# Altium project 2HE2E_Tester.PrjPcb (part 1 of 2)
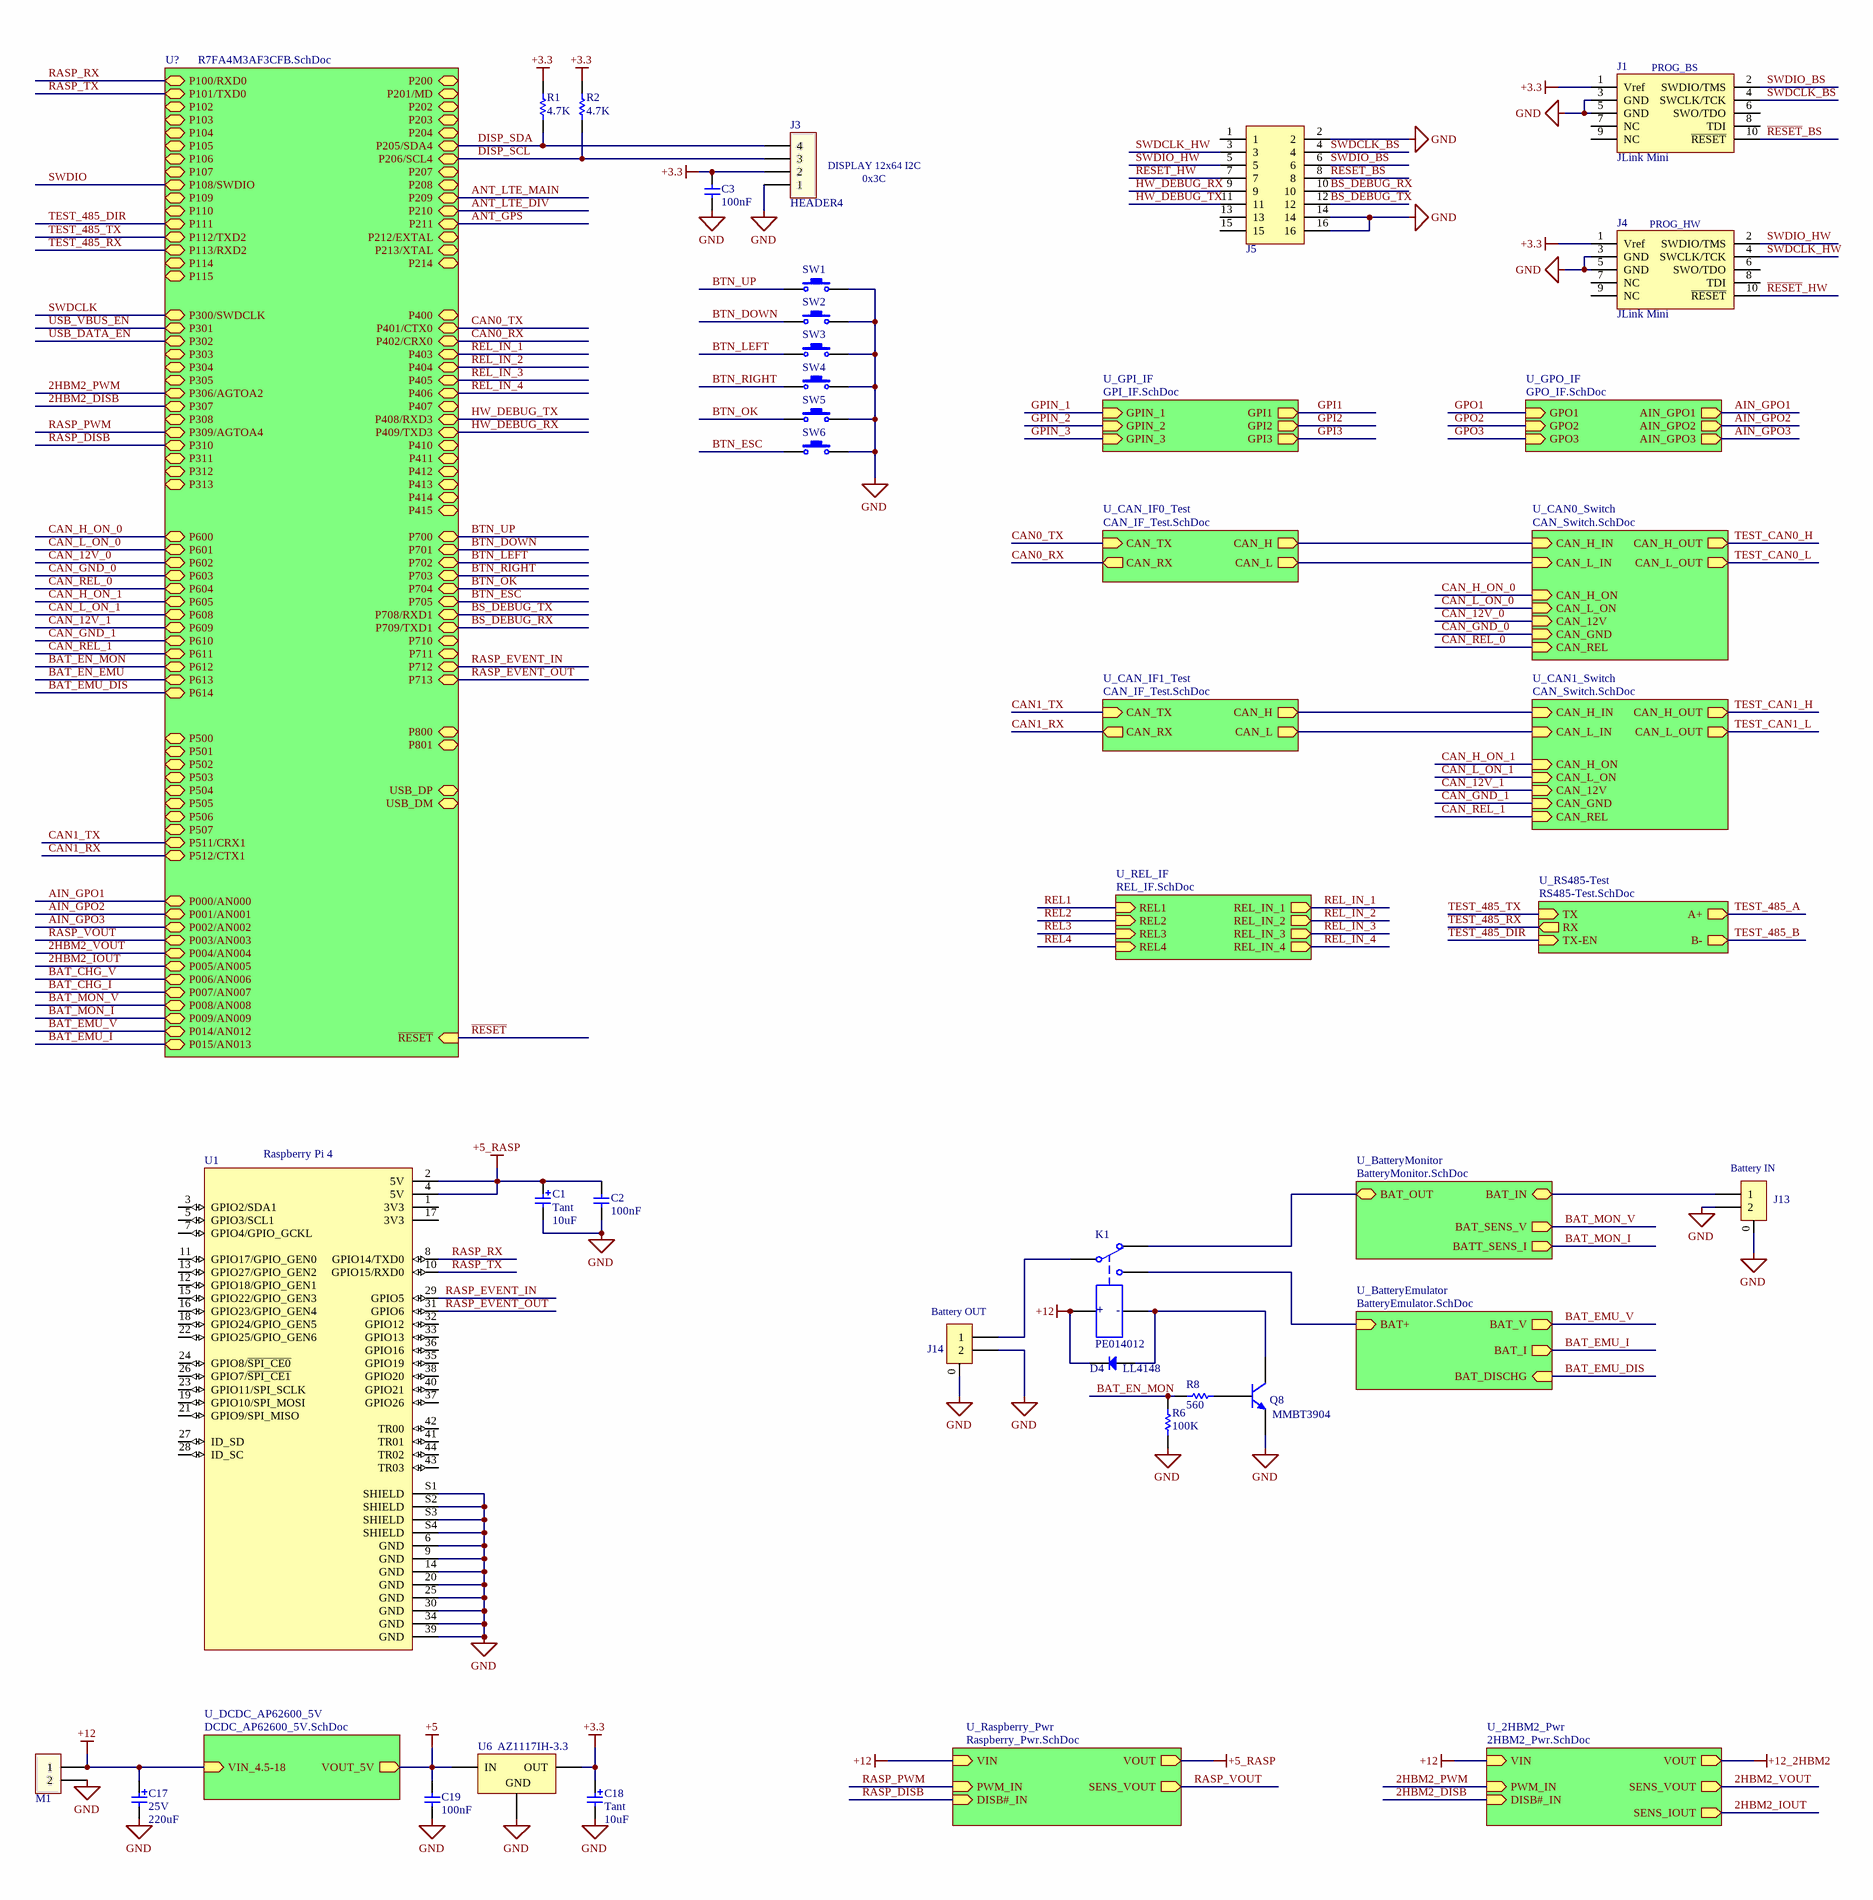
[diagram p0: 2HE2E_Tester.SchDoc, left]
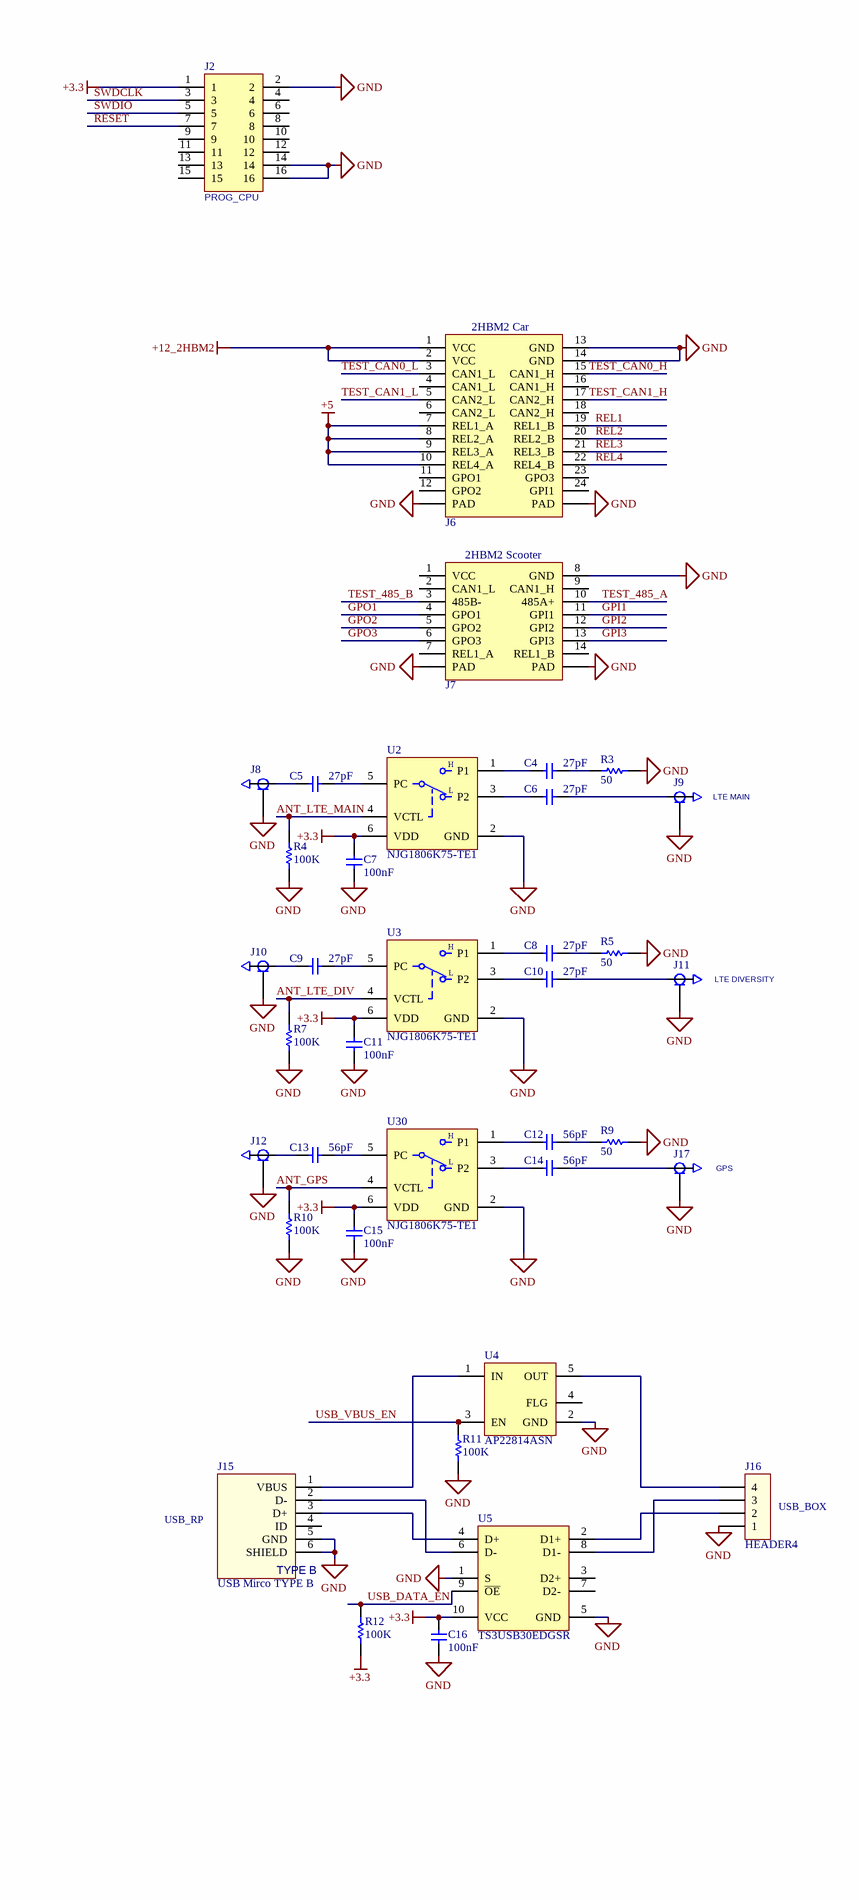
[diagram p1: 2HE2E_Tester.SchDoc, right]
13 sheets, 282 parts. Net scope: hierarchical (ports join the sheet entries above them; power ports are global).
Board file: 2HE2E_Tester.PcbDoc
Sheets:
  2HE2E_Tester.SchDoc
    U_RS485-Test = RS485-Test.SchDoc
    U_CAN_IF0_Test = CAN_IF_Test.SchDoc
    U_CAN_IF1_Test = CAN_IF_Test.SchDoc
    U_GPO_IF = GPO_IF.SchDoc
    U_REL_IF = REL_IF.SchDoc
    U_GPI_IF = GPI_IF.SchDoc
    U_DCDC_AP62600_5V = DCDC_AP62600_5V.SchDoc
    U_CAN0_Switch = CAN_Switch.SchDoc
    U_CAN1_Switch = CAN_Switch.SchDoc
    U? = R7FA4M3AF3CFB.SchDoc
    U_Raspberry_Pwr = Raspberry_Pwr.SchDoc
    U_2HBM2_Pwr = 2HBM2_Pwr.SchDoc
    U_BatteryEmulator = BatteryEmulator.SchDoc
    U_BatteryMonitor = BatteryMonitor.SchDoc

## Sheet 2HE2E_Tester.SchDoc
size A2; SheetNumber: 1; SheetTotal: 13

### Parts
C1  Tant  value 10uF  [Cap CASE B]
C2  value 100nF  [0603M-C]  (hidden comment: Cap Ceramic)
C3  value 100nF  [0603M-C]  (hidden comment: Cap Ceramic)
C4  value 27pF  [0402M-C]  (hidden comment: Cap Ceramic)
C5  value 27pF  [0402M-C]  (hidden comment: Cap Ceramic)
C6  value 27pF  [0402M-C]  (hidden comment: Cap Ceramic)
C7  value 100nF  [0603M-C]  (hidden comment: Cap Ceramic)
C8  value 27pF  [0402M-C]  (hidden comment: Cap Ceramic)
C9  value 27pF  [0402M-C]  (hidden comment: Cap Ceramic)
C10  value 27pF  [0402M-C]  (hidden comment: Cap Ceramic)
C11  value 100nF  [0603M-C]  (hidden comment: Cap Ceramic)
C12  value 56pF  [0402M-C]  (hidden comment: Cap Ceramic)
C13  value 56pF  [0402M-C]  (hidden comment: Cap Ceramic)
C14  value 56pF  [0402M-C]  (hidden comment: Cap Ceramic)
C15  value 100nF  [0603M-C]  (hidden comment: Cap Ceramic)
C16  value 100nF  [0603M-C]  (hidden comment: Cap Ceramic)
C17  25V  value 220uF  [Cap Elet SMD 8.0 mm CASE F-H10.5mm]
C18  Tant  value 10uF  [Cap CASE B]
C19  value 100nF  [0603M-C]  (hidden comment: Cap Ceramic)
D4  LL4148  [SOD80]
J1  JLink Mini  [HEADER5x2-127]
J2  Header 8x2  [Header 8x2 WE62101621021]  (value not drawn)
J3  HEADER4  [HEADER4]
J4  JLink Mini  [HEADER5x2-127]
J5  Header 8x2  [Header 8x2 WE62101621021]  (value not drawn)
J6  2HBM2 Car  [WR-MPC3 24N 662024231722]
J7  2HBM2 Scooter  [WR-MPC3 14N 662014231722]
J8  Antenna Ipex MHFx  [COAX IPEX MHF1_20279-001E-03]  (value not drawn)
J9  Antenna Ipex MHFx  [COAX IPEX MHF1_20279-001E-03]  (value not drawn)
J10  Antenna Ipex MHFx  [COAX IPEX MHF1_20279-001E-03]  (value not drawn)
J11  Antenna Ipex MHFx  [COAX IPEX MHF1_20279-001E-03]  (value not drawn)
J12  Antenna Ipex MHFx  [COAX IPEX MHF1_20279-001E-03]  (value not drawn)
J13  Connettore 2x1+GND  [JST_S2B-PH-SM4-TB]  (value not drawn)
J14  Connettore 2x1+GND  [JST_S2B-PH-SM4-TB]  (value not drawn)
J15  USB Mirco TYPE B  [USB Micro Type B - WE629105136821]
J16  HEADER4  [HEADER4]
J17  Antenna Ipex MHFx  [COAX IPEX MHF1_20279-001E-03]  (value not drawn)
K1  PE014012  [Relay PE]
M1  Morsetto 2 Poli  [Morsetto-2 poli-5.08]  (value not drawn)
Q8  MMBT3904  [SOT23 BSR14]
R1  value 4.7K  [0603M]  (hidden comment: Resistor)
R2  value 4.7K  [0603M]  (hidden comment: Resistor)
R3  value 50  [0603M]  (hidden comment: Resistor)
R4  value 100K  [0603M]  (hidden comment: Resistor)
R5  value 50  [0603M]  (hidden comment: Resistor)
R6  value 100K  [0603M]  (hidden comment: Resistor)
R7  value 100K  [0603M]  (hidden comment: Resistor)
R8  value 560  [0603M]  (hidden comment: Resistor)
R9  value 50  [0603M]  (hidden comment: Resistor)
R10  value 100K  [0603M]  (hidden comment: Resistor)
R11  value 100K  [0603M]  (hidden comment: Resistor)
R12  value 100K  [0603M]  (hidden comment: Resistor)
SW1  Button  [Button 6x6 PHT]  (value not drawn)
SW2  Button  [Button 6x6 PHT]  (value not drawn)
SW3  Button  [Button 6x6 PHT]  (value not drawn)
SW4  Button  [Button 6x6 PHT]  (value not drawn)
SW5  Button  [Button 6x6 PHT]  (value not drawn)
SW6  Button  [Button 6x6 PHT]  (value not drawn)
U1  Raspberry Pi 4  [MODULE RASPBERRY PI 4B]
U2  NJG1806K75-TE1  [NJG1806K75TE1]
U3  NJG1806K75-TE1  [NJG1806K75TE1]
U4  AP22814ASN  [U-DFN2020-127P600-6N]
U5  TS3USB30EDGSR  [TSSOP50P491-10N]
U6  AZ1117IH-3.3  [SOT223-SOT230P700X180-4N]
U30  NJG1806K75-TE1  [NJG1806K75TE1]

### Sub-sheets
U? = R7FA4M3AF3CFB.SchDoc: P400 (bidir), P403 (bidir), P404 (bidir), P405 (bidir), P406 (bidir), P700 (bidir), P701 (bidir), P702 (bidir), P703 (bidir), P704 (bidir), P705 (bidir), P213/XTAL (bidir), P212/EXTAL (bidir), P713 (bidir), P712 (bidir), P711 (bidir), P415 (bidir), P414 (bidir), P413 (bidir), P412 (bidir), P411 (bidir), P410 (bidir), P407 (bidir), USB_DM (bidir), USB_DP (bidir), P207 (bidir), P204 (bidir), P203 (bidir), P202 (bidir), P313 (bidir), P214 (bidir), P211 (bidir), P210 (bidir), P209 (bidir), P208 (bidir), P201/MD (bidir), P200 (bidir), P312 (bidir), P311 (bidir), P310 (bidir), P308 (bidir), P307 (bidir), P305 (bidir), P304 (bidir), P303 (bidir), P302 (bidir), P301 (bidir), P300/SWDCLK (bidir), P108/SWDIO (bidir), P109 (bidir), P110 (bidir), P111 (bidir), P114 (bidir), P115 (bidir), P608 (bidir), P609 (bidir), P610 (bidir), P611 (bidir), P612 (bidir), P613 (bidir), P614 (bidir), P605 (bidir), P604 (bidir), P603 (bidir), P602 (bidir), P601 (bidir), P600 (bidir), P107 (bidir), P106 (bidir), P105 (bidir), P104 (bidir), P103 (bidir), P102 (bidir), P800 (bidir), P801 (bidir), P500 (bidir), P501 (bidir), P502 (bidir), P503 (bidir), P504 (bidir), P505 (bidir), P506 (bidir), P507 (bidir), ~{RESET} (in), P512/CTX1 (bidir), P511/CRX1 (bidir), P401/CTX0 (bidir), P402/CRX0 (bidir), P002/AN002 (bidir), P001/AN001 (bidir), P000/AN000 (bidir), P101/TXD0 (bidir), P100/RXD0 (bidir), P112/TXD2 (bidir), P113/RXD2 (bidir), P710 (bidir), P709/TXD1 (bidir), P708/RXD1 (bidir), P409/TXD3 (bidir), P408/RXD3 (bidir), P306/AGTOA2 (bidir), P309/AGTOA4 (bidir), P005/AN005 (bidir), P004/AN004 (bidir), P003/AN003 (bidir), P007/AN007 (bidir), P006/AN006 (bidir), P015/AN013 (bidir), P014/AN012 (bidir), P009/AN009 (bidir), P008/AN008 (bidir), P206/SCL4 (bidir), P205/SDA4 (bidir)
U_2HBM2_Pwr = 2HBM2_Pwr.SchDoc: SENS_VOUT (out), SENS_IOUT (out), PWM_IN (in), DISB#_IN (in), VOUT (out), VIN (in)
U_BatteryEmulator = BatteryEmulator.SchDoc: BAT+ (in), BAT_DISCHG (in), BAT_V (out), BAT_I (out)
U_BatteryMonitor = BatteryMonitor.SchDoc: BAT_SENS_V (out), BATT_SENS_I (out), BAT_OUT (bidir), BAT_IN (bidir)
U_CAN0_Switch = CAN_Switch.SchDoc: CAN_H_IN (in), CAN_L_IN (in), CAN_REL (in), CAN_H_OUT (out), CAN_L_OUT (out), CAN_12V (in), CAN_GND (in), CAN_H_ON (in), CAN_L_ON (in)
U_CAN1_Switch = CAN_Switch.SchDoc: CAN_H_IN (in), CAN_L_IN (in), CAN_REL (in), CAN_H_OUT (out), CAN_L_OUT (out), CAN_12V (in), CAN_GND (in), CAN_H_ON (in), CAN_L_ON (in)
U_CAN_IF0_Test = CAN_IF_Test.SchDoc: CAN_TX (in), CAN_RX (out), CAN_L (out), CAN_H (out)
U_CAN_IF1_Test = CAN_IF_Test.SchDoc: CAN_TX (in), CAN_RX (out), CAN_L (out), CAN_H (out)
U_DCDC_AP62600_5V = DCDC_AP62600_5V.SchDoc: VIN_4.5-18 (in), VOUT_5V (out)
U_GPI_IF = GPI_IF.SchDoc: GPI1 (out), GPIN_1 (in), GPI2 (out), GPI3 (out), GPIN_2 (in), GPIN_3 (in)
U_GPO_IF = GPO_IF.SchDoc: GPO1 (in), GPO2 (in), GPO3 (in), AIN_GPO1 (out), AIN_GPO2 (out), AIN_GPO3 (out)
U_Raspberry_Pwr = Raspberry_Pwr.SchDoc: SENS_VOUT (out), PWM_IN (in), DISB#_IN (in), VOUT (out), VIN (in)
U_REL_IF = REL_IF.SchDoc: REL1 (in), REL_IN_1 (out), REL2 (in), REL_IN_2 (out), REL3 (in), REL_IN_3 (out), REL4 (in), REL_IN_4 (out)
U_RS485-Test = RS485-Test.SchDoc: RX (out), TX-EN (in), TX (in), A+ (out), B- (out)

### Nets
+3.3: C3.1 C7.1 C11.1 C15.1 C16.1 C18.1 J1.1(Vref) J2.1 J3.2 J4.1(Vref) R1.2 R2.2 R12.1 U2.6(VDD) U3.6(VDD) U5.10(VCC) U6.2(OUT) U30.6(VDD)
+5: C19.1 J6.7(REL1_A) J6.8(REL2_A) J6.9(REL3_A) J6.10(REL4_A) U6.3(IN) ; sheet U_DCDC_AP62600_5V/VOUT_5V
+5_RASP: C1.1 C2.1 U1.2(5V) U1.4(5V) ; sheet U_Raspberry_Pwr/VOUT  [project net VOUT_RP]
+12: C17.1 D4.2(K) K1.1 M1.1 ; sheet U_DCDC_AP62600_5V/VIN_4.5-18, sheet U_Raspberry_Pwr/VIN, sheet U_2HBM2_Pwr/VIN
+12_2HBM2: J6.1(VCC) J6.2(VCC) ; sheet U_2HBM2_Pwr/VOUT  [project net VOUT_2H]
GND: C1.2 C2.2 C3.2 C7.2 C11.2 C15.2 C16.2 C17.2 C18.2 C19.2 J1.3(GND) J1.5(GND) J2.2 J2.14 J2.16 J3.1 J4.3(GND) J4.5(GND) J5.2 J5.14 J5.16 J6.13(GND) J6.14(GND) J6.MP1(PAD) J6.MP2(PAD) J7.8(GND) J7.MP1(PAD) J7.MP2(PAD) J8.2(GND) J9.2(GND) J10.2(GND) J11.2(GND) J12.2(GND) J13.0 J13.2 J14.0 J14.2 J15.5(GND) J15.6(SHIELD) J16.1 J17.2(GND) M1.2 Q8.3(E) R3.1 R4.1 R5.1 R6.2 R7.1 R9.1 R10.1 R11.1 SW1.2 SW2.2 SW3.2 SW4.2 SW5.2 SW6.2 U1.6(GND) U1.9(GND) U1.14(GND) U1.20(GND) U1.25(GND) U1.30(GND) U1.34(GND) U1.39(GND) U1.S1(SHIELD) U1.S2(SHIELD) U1.S3(SHIELD) U1.S4(SHIELD) U2.2(GND) U3.2(GND) U4.2(GND) U5.1(S) U5.5(GND) U6.1(GND) U30.2(GND)
2HBM2_DISB: sheet U?/P307, sheet U_2HBM2_Pwr/DISB#_IN
2HBM2_IOUT: sheet U?/P005/AN005, sheet U_2HBM2_Pwr/SENS_IOUT
2HBM2_PWM: sheet U?/P306/AGTOA2, sheet U_2HBM2_Pwr/PWM_IN
2HBM2_VOUT: sheet U?/P004/AN004, sheet U_2HBM2_Pwr/SENS_VOUT
AIN_GPO1: sheet U_GPO_IF/AIN_GPO1, sheet U?/P000/AN000
AIN_GPO2: sheet U_GPO_IF/AIN_GPO2, sheet U?/P001/AN001
AIN_GPO3: sheet U_GPO_IF/AIN_GPO3, sheet U?/P002/AN002
ANT_GPS: R10.2 U30.4(VCTL) ; sheet U?/P211
ANT_LTE_DIV: R7.2 U3.4(VCTL) ; sheet U?/P210
ANT_LTE_MAIN: R4.2 U2.4(VCTL) ; sheet U?/P209
BAT_EMU_DIS: sheet U?/P614, sheet U_BatteryEmulator/BAT_DISCHG
BAT_EMU_I: sheet U?/P015/AN013, sheet U_BatteryEmulator/BAT_I
BAT_EMU_V: sheet U?/P014/AN012, sheet U_BatteryEmulator/BAT_V
BAT_EN_MON: R6.1 R8.1 ; sheet U?/P612
BAT_MON_I: sheet U?/P009/AN009, sheet U_BatteryMonitor/BATT_SENS_I
BAT_MON_V: sheet U?/P008/AN008, sheet U_BatteryMonitor/BAT_SENS_V
BS_DEBUG_RX: J5.10 ; sheet U?/P709/TXD1
BS_DEBUG_TX: J5.12 ; sheet U?/P708/RXD1
BTN_DOWN: SW2.1 ; sheet U?/P701
BTN_ESC: SW6.1 ; sheet U?/P705
BTN_LEFT: SW3.1 ; sheet U?/P702
BTN_OK: SW5.1 ; sheet U?/P704
BTN_RIGHT: SW4.1 ; sheet U?/P703
BTN_UP: SW1.1 ; sheet U?/P700
CAN0_RX: sheet U_CAN_IF0_Test/CAN_RX, sheet U?/P402/CRX0
CAN0_TX: sheet U_CAN_IF0_Test/CAN_TX, sheet U?/P401/CTX0
CAN1_RX: sheet U_CAN_IF1_Test/CAN_RX, sheet U?/P512/CTX1
CAN1_TX: sheet U_CAN_IF1_Test/CAN_TX, sheet U?/P511/CRX1
CAN_12V_0: sheet U_CAN0_Switch/CAN_12V, sheet U?/P602
CAN_12V_1: sheet U_CAN1_Switch/CAN_12V, sheet U?/P609
CAN_GND_0: sheet U_CAN0_Switch/CAN_GND, sheet U?/P603
CAN_GND_1: sheet U_CAN1_Switch/CAN_GND, sheet U?/P610
CAN_H_ON_0: sheet U_CAN0_Switch/CAN_H_ON, sheet U?/P600
CAN_H_ON_1: sheet U_CAN1_Switch/CAN_H_ON, sheet U?/P605
CAN_L_ON_0: sheet U_CAN0_Switch/CAN_L_ON, sheet U?/P601
CAN_L_ON_1: sheet U_CAN1_Switch/CAN_L_ON, sheet U?/P608
CAN_REL_0: sheet U_CAN0_Switch/CAN_REL, sheet U?/P604
CAN_REL_1: sheet U_CAN1_Switch/CAN_REL, sheet U?/P611
DISP_SCL: J3.3 R2.1 ; sheet U?/P206/SCL4
DISP_SDA: J3.4 R1.1 ; sheet U?/P205/SDA4
GPI1: J7.11(GPI1) ; sheet U_GPI_IF/GPI1
GPI2: J7.12(GPI2) ; sheet U_GPI_IF/GPI2
GPI3: J7.13(GPI3) ; sheet U_GPI_IF/GPI3
GPO1: J7.4(GPO1) ; sheet U_GPO_IF/GPO1
GPO2: J7.5(GPO2) ; sheet U_GPO_IF/GPO2
GPO3: J7.6(GPO3) ; sheet U_GPO_IF/GPO3
HW_DEBUG_RX: J5.9 ; sheet U?/P409/TXD3
HW_DEBUG_TX: J5.11 ; sheet U?/P408/RXD3
~{RESET}: J2.7 ; sheet U?/~{RESET}
~{RESET}_BS: J1.10(~{RESET}) J5.8
~{RESET}_HW: J4.10(~{RESET}) J5.7
RASP_DISB: sheet U?/P310, sheet U_Raspberry_Pwr/DISB#_IN
RASP_EVENT_IN: U1.29(GPIO5) ; sheet U?/P712
RASP_EVENT_OUT: U1.31(GPIO6) ; sheet U?/P713
RASP_PWM: sheet U?/P309/AGTOA4, sheet U_Raspberry_Pwr/PWM_IN
RASP_RX: U1.8(GPIO14/TXD0) ; sheet U?/P100/RXD0
RASP_TX: U1.10(GPIO15/RXD0) ; sheet U?/P101/TXD0
RASP_VOUT: sheet U?/P003/AN003, sheet U_Raspberry_Pwr/SENS_VOUT
REL1: J6.19(REL1_B) ; sheet U_REL_IF/REL1
REL2: J6.20(REL2_B) ; sheet U_REL_IF/REL2
REL3: J6.21(REL3_B) ; sheet U_REL_IF/REL3
REL4: J6.22(REL4_B) ; sheet U_REL_IF/REL4
REL_IN_1: sheet U_REL_IF/REL_IN_1, sheet U?/P403
REL_IN_2: sheet U_REL_IF/REL_IN_2, sheet U?/P404
REL_IN_3: sheet U_REL_IF/REL_IN_3, sheet U?/P405
REL_IN_4: sheet U_REL_IF/REL_IN_4, sheet U?/P406
SWDCLK: J2.3 ; sheet U?/P300/SWDCLK
SWDCLK_BS: J1.4(SWCLK/TCK) J5.4
SWDCLK_HW: J4.4(SWCLK/TCK) J5.3
SWDIO: J2.5 ; sheet U?/P108/SWDIO
SWDIO_BS: J1.2(SWDIO/TMS) J5.6
SWDIO_HW: J4.2(SWDIO/TMS) J5.5
TEST_485_A: J7.10(485A+) ; sheet U_RS485-Test/A+
TEST_485_B: J7.3(485B-) ; sheet U_RS485-Test/B-
TEST_485_DIR: sheet U_RS485-Test/TX-EN, sheet U?/P111
TEST_485_RX: sheet U_RS485-Test/RX, sheet U?/P113/RXD2
TEST_485_TX: sheet U_RS485-Test/TX, sheet U?/P112/TXD2
TEST_CAN0_H: J6.15(CAN1_H) ; sheet U_CAN0_Switch/CAN_H_OUT
TEST_CAN0_L: J6.3(CAN1_L) ; sheet U_CAN0_Switch/CAN_L_OUT
TEST_CAN1_H: J6.17(CAN2_H) ; sheet U_CAN1_Switch/CAN_H_OUT
TEST_CAN1_L: J6.5(CAN2_L) ; sheet U_CAN1_Switch/CAN_L_OUT
USB_DATA_EN: R12.2 U5.9(~{OE}) ; sheet U?/P302
USB_VBUS_EN: R11.2 U4.3(EN) ; sheet U?/P301
VOUT: K1.10 ; sheet U_BatteryMonitor/BAT_OUT
NetC4_1: C4.1 U2.1(P1)
NetC4_2: C4.2 R3.2
NetC5_1: C5.1 J8.1(SIGNAL)
NetC5_2: C5.2 U2.5(PC)
NetC6_1: C6.1 U2.3(P2)
NetC6_2: C6.2 J9.1(SIGNAL)
NetC8_1: C8.1 U3.1(P1)
NetC8_2: C8.2 R5.2
NetC9_1: C9.1 J10.1(SIGNAL)
NetC9_2: C9.2 U3.5(PC)
NetC10_1: C10.1 U3.3(P2)
NetC10_2: C10.2 J11.1(SIGNAL)
NetC12_1: C12.1 U30.1(P1)
NetC12_2: C12.2 R9.2
NetC13_1: C13.1 J12.1(SIGNAL)
NetC13_2: C13.2 U30.5(PC)
NetC14_1: C14.1 U30.3(P2)
NetC14_2: C14.2 J17.1(SIGNAL)
NetC37_1_2: sheet U_CAN_IF0_Test/CAN_L, sheet U_CAN0_Switch/CAN_L_IN
NetC37_2_2: sheet U_CAN_IF1_Test/CAN_L, sheet U_CAN1_Switch/CAN_L_IN
NetC38_1_2: sheet U_CAN_IF0_Test/CAN_H, sheet U_CAN0_Switch/CAN_H_IN
NetC38_2_2: sheet U_CAN_IF1_Test/CAN_H, sheet U_CAN1_Switch/CAN_H_IN
NetD4_1: D4.1(A) K1.6 Q8.1(C)
NetJ13_1: J13.1 ; sheet U_BatteryMonitor/BAT_IN
NetJ14_1: J14.1 K1.7
NetJ15_1: J15.1(VBUS) U4.1(IN)
NetJ15_2: J15.2(D-) U5.6(D-)
NetJ15_3: J15.3(D+) U5.4(D+)
NetJ16_2: J16.2 U5.2(D1+)
NetJ16_3: J16.3 U5.8(D1-)
NetJ16_4: J16.4 U4.5(OUT)
NetK1_12: K1.12 ; sheet U_BatteryEmulator/BAT+
NetQ8_2: Q8.2(B) R8.2

Not connected (* = marked no-connect by the designer): J1 6(SWO/TDO) 7(NC) 8(TDI) 9(NC); J2 4 6 8 9 10 11 12 13 15; J4 6(SWO/TDO) 7(NC) 8(TDI) 9(NC); J5 1 13 15; J6 4(CAN1_L) 6(CAN2_L) 11(GPO1) 12(GPO2) 16(CAN1_H) 18(CAN2_H) 23(GPO3) 24(GPI1); J7 1(VCC) 2(CAN1_L) 7(REL1_A) 9(CAN1_H) 14(REL1_B); J15 4(ID); U1 1(3V3) 3(GPIO2/SDA1) 5(GPIO3/SCL1) 7(GPIO4/GPIO_GCKL) 11(GPIO17/GPIO_GEN0) 12(GPIO18/GPIO_GEN1) 13(GPIO27/GPIO_GEN2) 15(GPIO22/GPIO_GEN3) 16(GPIO23/GPIO_GEN4) 17(3V3) 18(GPIO24/GPIO_GEN5) 19(GPIO10/SPI_MOSI) 21(GPIO9/SPI_MISO) 22(GPIO25/GPIO_GEN6) 23(GPIO11/SPI_SCLK) 24(GPIO8/~{SPI_CE0}) 26(GPIO7/~{SPI_CE1}) 27(ID_SD) 28(ID_SC) 32(GPIO12) 33(GPIO13) 35(GPIO19) 36(GPIO16) 37(GPIO26) 38(GPIO20) 40(GPIO21) 41(TR01) 42(TR00) 43(TR03) 44(TR02); U4 4(FLG); U5 3(D2+) 7(D2-)

### Notes on the sheet
- (near J1) PROG_BS
- (near J3) DISPLAY 12x64 I2C
- 0x3C
- (near J2) PROG_CPU
- (near J4) PROG_HW
- (near J9) LTE MAIN
- (near J11) LTE DIVERSITY
- (near J13) Battery IN
- (near J17) GPS
- (near J14) Battery OUT
- USB_RP
- (near J16) USB_BOX
- Title
- Size:
- Date:
- A4
- Number:
- Time:
- Revision:
- Sheet
- of
- File:
- (in symbol NJG1806K75-TE1) H; L
- (in symbol Relay SPDT) +; -
- (in symbol USB Micro_TYPEB) TYPE B

### Library data of the parts
C1 C18 = Cap Tantalio: Capacitor tantalio SMD
C2-C16 C19 = Cap Ceramic: Ceramic Capacitor
C17 = Cap Elettrolitico: Condensatore elettrolitico
D4 = Diodo: Small Signal Diode
J1 J4 = Connettore JLink Mini: Connettore JTAG/SWD 5x2 P1.27 JLink Mini
J2 J5 = Header 8x2: WE 62101621021
J3 J16 = HEADER4: Header 4 pin
J6 = Connettore 2Hire 2HBM2_Car: Connettore 12x2 WE 662024231722
J7 = Connettore 2Hire 2HBM2_Scooter: Connettore 7x2 WE 662014231722
J8-J12 J17 = Connettore Ipex MHFx: 1 POS Vertical SMD Small form factor with big performance through 6 GHz connector, RF, micro-coaxial MHF x Receptacle; MP: 20449-001E-03; MF: I-PEX; SnapEDA_Link: https://www.snapeda.com/parts/20449-001E-03/I-PEX/view-part/?ref=snap; Package: None; Check_prices: https://www.snapeda.com/parts/20449-001E-03/I-PEX/view-part/?ref=eda; Purchase-URL: https://pricing.snapeda.com/search/part/20449-001E-03/?ref=eda; Price: None; Value: *; Availability: In Stock
J13 J14 = Connettore 2x1+GND: Connettore 2x1
J15 = USB Micro_TYPEB: Connettore MicroUSB Client (TYPE B)
K1 = Relay SPDT: Relay DPDT Coil 12V PE014012
M1 = Morsetto 2 Poli: Morsetto 2 poli PCB
Q8 = Transistor NPN: NPN Bipolar Transistor
SW1-SW6 = Button: Button SPST
U1 = Raspberry Pi 4: BCM2711 Raspberry Pi 4 Model B 4GB - ARM Cortex-A72 MPU Embedded Evaluation Board; MP: RASPBERRY PI 4B/4GB; Price: None; MF: Raspberry Pi; Check_prices: https://www.snapeda.com/parts/RASPBERRY%20PI%204B/4GB/Raspberry+Pi/view-part/?ref=eda; Value: *; Purchase-URL: https://pricing.snapeda.com/search/part/RASPBERRY PI 4B/4GB/?ref=eda; Availability: In Stock; SnapEDA_Link: https://www.snapeda.com/parts/RASPBERRY%20PI%204B/4GB/Raspberry+Pi/view-part/?ref=snap; Package: None
U2 U3 U30 = NJG1806K75-TE1: RF Switch ICs 1bit SPDT Switch IC GaAs MMIC
U4 = AP22814ASN: Single  channel current-limited  integrated high-side power switch - Active High - DFN
U5 = TS3USB30EDGSR: High-Speed USB 2.0 (480-Mbps) 1:2 Multiplexer/Demultiplexer Switch With Single Enable
U6 = AZ1117IH: Regolatore LDO fixed 3.3V 1A

## Sheet RS485-Test.SchDoc: RS485 Interface
size A4; DrawnBy: Marini; DocumentNumber: 2HSGB; Revision: 1.1; SheetNumber: 4; SheetTotal: 13
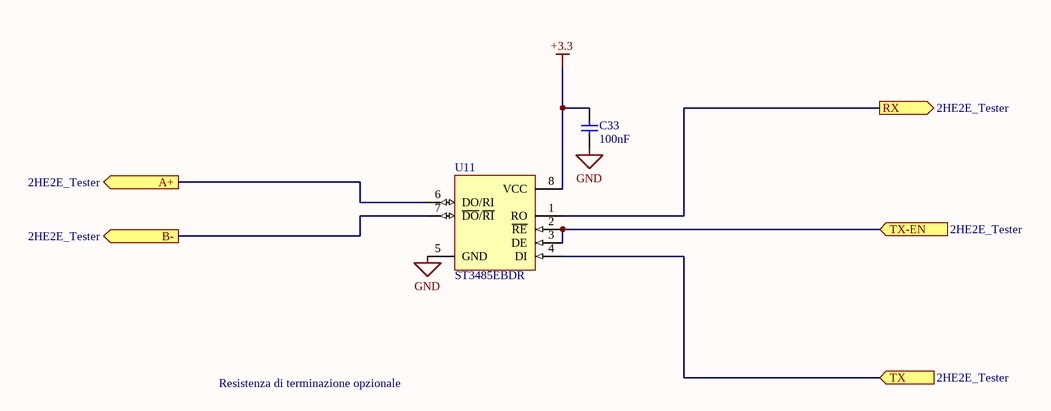
[diagram p2: RS485-Test.SchDoc]

### Parts
C33  value 100nF  [0603M-C]  (hidden comment: Cap Ceramic)
U11  ST3485EBDR  [SOIC127P600-8N]

### Ports
A+ (out, see 2HE2E_Tester), B- (out, see 2HE2E_Tester), RX (out, see 2HE2E_Tester), TX (in, see 2HE2E_Tester), TX-EN (in, see 2HE2E_Tester)

### Nets
+3.3: C33.1 U11.8(VCC)
GND: C33.2 U11.5(GND)
TEST_485_A: U11.6(DO/RI) ; port A+
TEST_485_B: U11.7(~{DO}/~{RI}) ; port B-
TEST_485_DIR: U11.2(~{RE}) U11.3(DE) ; port TX-EN
TEST_485_RX: U11.1(RO) ; port RX
TEST_485_TX: U11.4(DI) ; port TX

### Notes on the sheet
- Resistenza di terminazione opzionale

### Library data of the parts
C33 = Cap Ceramic: Ceramic Capacitor 25V
U11 = DS75176BM: Multipoint RS-485/RS-422 Transceiver

## Sheet CAN_IF_Test.SchDoc
size A4; SheetNumber: 7; SheetTotal: 13
Used 2 times, as channels U_CAN_IF0_Test, U_CAN_IF1_Test. Parts and nets are listed once, with the designators drawn on the sheet.
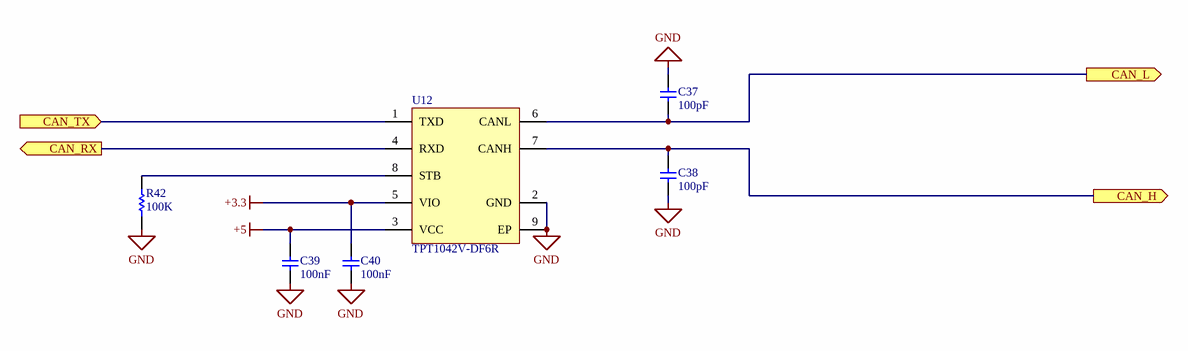
[diagram p3: CAN_IF_Test.SchDoc]

### Parts
C37  value 100pF  [0603M]  (hidden comment: Cap Ceramic)
C38  value 100pF  [0603M]  (hidden comment: Cap Ceramic)
C39  value 100nF  [0603M-C]  (hidden comment: Cap Ceramic)
C40  value 100nF  [0603M-C]  (hidden comment: Cap Ceramic)
R42  value 100K  [0603M]  (hidden comment: Resistor)
U12  TPT1042V-DF6R  [HVSON8-0.65mm]

### Ports
CAN_H (out, see 2HE2E_Tester), CAN_L (out, see 2HE2E_Tester), CAN_RX (out, see 2HE2E_Tester), CAN_TX (in, see 2HE2E_Tester)

### Nets
+3.3: C40.2 U12.5(VIO)
+5: C39.2 U12.3(VCC)
GND: C37.1 C38.1 C39.1 C40.1 R42.1 U12.2(GND) U12.9(EP)
CAN_H: C38.2 U12.7(CANH) ; port CAN_H
CAN_L: C37.2 U12.6(CANL) ; port CAN_L
CAN_RX: U12.4(RXD) ; port CAN_RX
CAN_TX: U12.1(TXD) ; port CAN_TX
NetR42_2: R42.2 U12.8(STB)

### Channels
U_CAN_IF0_Test: designators end in _1; ports CAN_H=NetC38_1_2 CAN_L=NetC37_1_2 CAN_RX=CAN0_RX CAN_TX=CAN0_TX
U_CAN_IF1_Test: designators end in _2; ports CAN_H=NetC38_2_2 CAN_L=NetC37_2_2 CAN_RX=CAN1_RX CAN_TX=CAN1_TX

### Notes on the sheet
- Title
- Size:
- Date:
- A4
- Number:
- Time:
- Revision:
- Sheet
- of
- File:

### Library data of the parts
C37 C38 = Cap Ceramic: Ceramic Capacitor 50V
C39 C40 = Cap Ceramic: Ceramic Capacitor 25V
U12 = TPT1042V: High-speed CAN transceiver with Standby mode and VIO

## Sheet GPO_IF.SchDoc
size A4; SheetNumber: 6; SheetTotal: 13
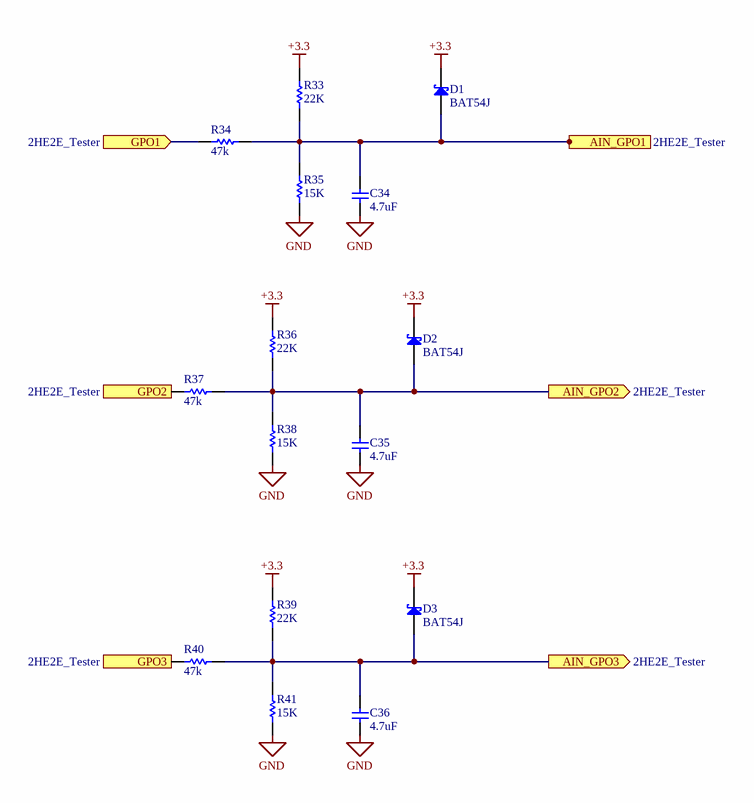
[diagram p4: GPO_IF.SchDoc]

### Parts
C34  value 4.7uF  [0603M-C]  (hidden comment: Cap Ceramic)
C35  value 4.7uF  [0603M-C]  (hidden comment: Cap Ceramic)
C36  value 4.7uF  [0603M-C]  (hidden comment: Cap Ceramic)
D1  BAT54J  [SOD323]
D2  BAT54J  [SOD323]
D3  BAT54J  [SOD323]
R33  value 22K  [0603M]  (hidden comment: Resistor)
R34  value 47k  [0603M]  (hidden comment: Resistor)
R35  value 15K  [0603M]  (hidden comment: Resistor)
R36  value 22K  [0603M]  (hidden comment: Resistor)
R37  value 47k  [0603M]  (hidden comment: Resistor)
R38  value 15K  [0603M]  (hidden comment: Resistor)
R39  value 22K  [0603M]  (hidden comment: Resistor)
R40  value 47k  [0603M]  (hidden comment: Resistor)
R41  value 15K  [0603M]  (hidden comment: Resistor)

### Ports
AIN_GPO1 (out, see 2HE2E_Tester), AIN_GPO2 (out, see 2HE2E_Tester), AIN_GPO3 (out, see 2HE2E_Tester), GPO1 (in, see 2HE2E_Tester), GPO2 (in, see 2HE2E_Tester), GPO3 (in, see 2HE2E_Tester)

### Nets
+3.3: D1.2(K) D2.2(K) D3.2(K) R33.2 R36.2 R39.2
GND: C34.1 C35.1 C36.1 R35.1 R38.1 R41.1
AIN_GPO1: C34.2 D1.1(A) R33.1 R34.2 R35.2 ; port AIN_GPO1
AIN_GPO2: C35.2 D2.1(A) R36.1 R37.2 R38.2 ; port AIN_GPO2
AIN_GPO3: C36.2 D3.1(A) R39.1 R40.2 R41.2 ; port AIN_GPO3
GPO1: R34.1 ; port GPO1
GPO2: R37.1 ; port GPO2
GPO3: R40.1 ; port GPO3

### Notes on the sheet
- Title
- Size:
- Date:
- A4
- Number:
- Time:
- Revision:
- Sheet
- of
- File:

### Library data of the parts
C34-C36 = Cap Ceramic: Ceramic Capacitor
D1-D3 = Diodo Schottky

## Sheet REL_IF.SchDoc
size A4; SheetNumber: 5; SheetTotal: 13
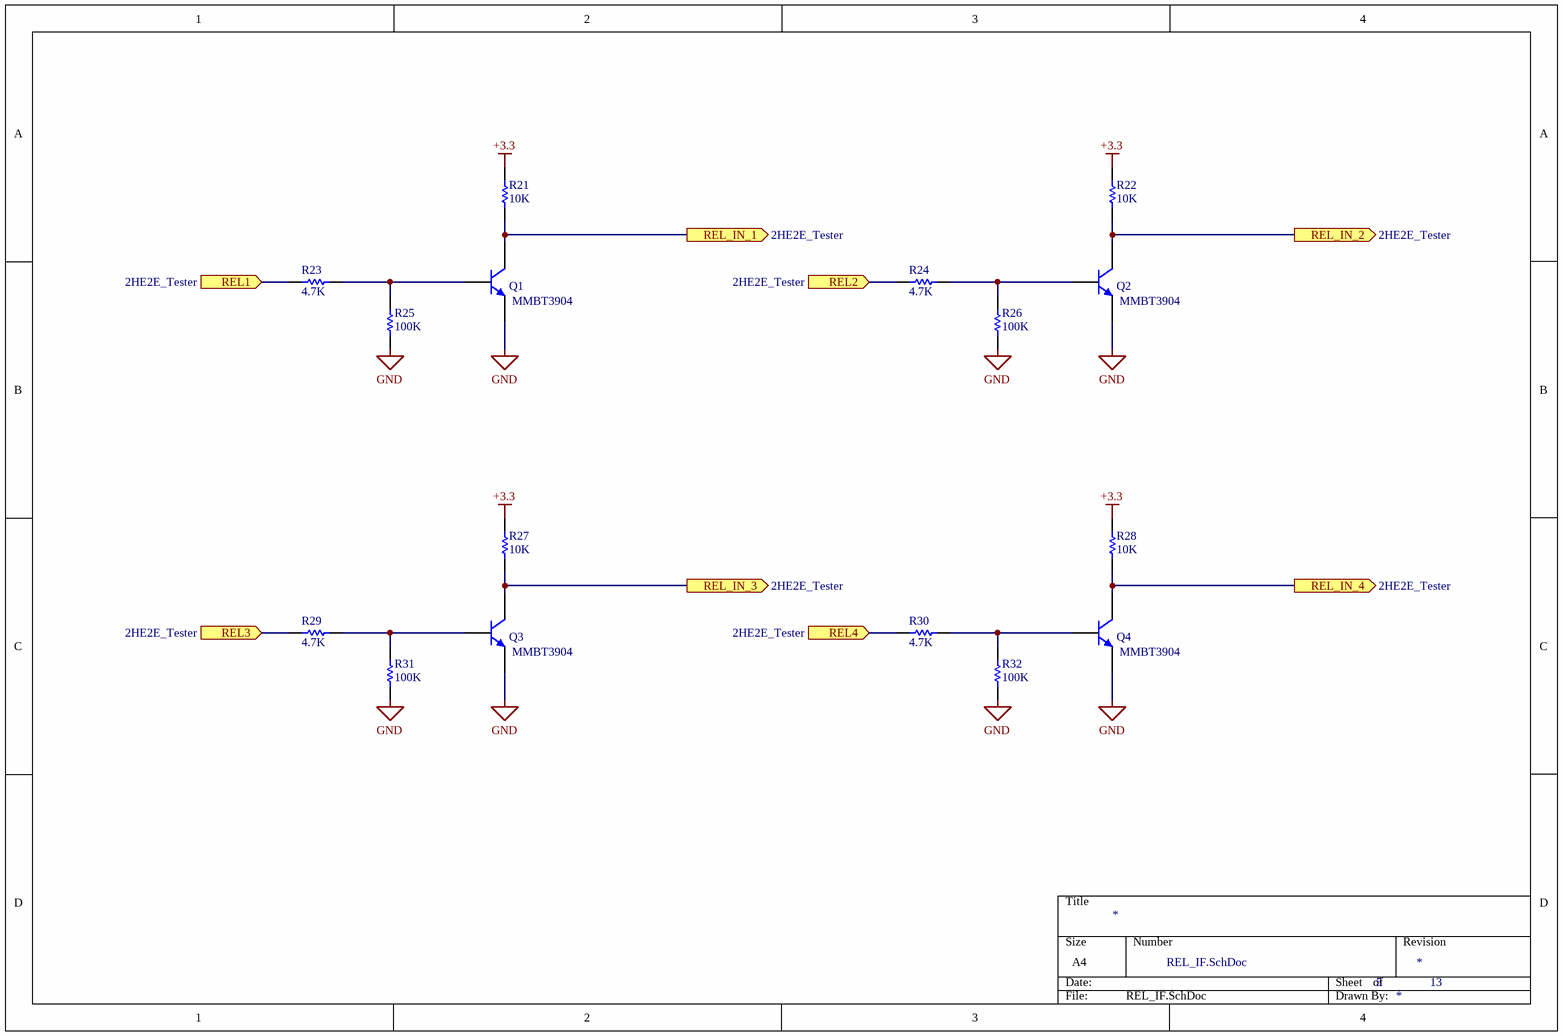
[diagram p5: REL_IF.SchDoc]

### Parts
Q1  MMBT3904  [SOT23 BSR14]
Q2  MMBT3904  [SOT23 BSR14]
Q3  MMBT3904  [SOT23 BSR14]
Q4  MMBT3904  [SOT23 BSR14]
R21  value 10K  [0603M]  (hidden comment: Resistor)
R22  value 10K  [0603M]  (hidden comment: Resistor)
R23  value 4.7K  [0603M]  (hidden comment: Resistor)
R24  value 4.7K  [0603M]  (hidden comment: Resistor)
R25  value 100K  [0603M]  (hidden comment: Resistor)
R26  value 100K  [0603M]  (hidden comment: Resistor)
R27  value 10K  [0603M]  (hidden comment: Resistor)
R28  value 10K  [0603M]  (hidden comment: Resistor)
R29  value 4.7K  [0603M]  (hidden comment: Resistor)
R30  value 4.7K  [0603M]  (hidden comment: Resistor)
R31  value 100K  [0603M]  (hidden comment: Resistor)
R32  value 100K  [0603M]  (hidden comment: Resistor)

### Ports
REL1 (in, see 2HE2E_Tester), REL2 (in, see 2HE2E_Tester), REL3 (in, see 2HE2E_Tester), REL4 (in, see 2HE2E_Tester), REL_IN_1 (out, see 2HE2E_Tester), REL_IN_2 (out, see 2HE2E_Tester), REL_IN_3 (out, see 2HE2E_Tester), REL_IN_4 (out, see 2HE2E_Tester)

### Nets
+3.3: R21.1 R22.1 R27.1 R28.1
GND: Q1.3(E) Q2.3(E) Q3.3(E) Q4.3(E) R25.2 R26.2 R31.2 R32.2
REL1: R23.1 ; port REL1
REL2: R24.1 ; port REL2
REL3: R29.1 ; port REL3
REL4: R30.1 ; port REL4
REL_IN_1: Q1.1(C) R21.2 ; port REL_IN_1
REL_IN_2: Q2.1(C) R22.2 ; port REL_IN_2
REL_IN_3: Q3.1(C) R27.2 ; port REL_IN_3
REL_IN_4: Q4.1(C) R28.2 ; port REL_IN_4
NetQ1_2: Q1.2(B) R23.2 R25.1
NetQ2_2: Q2.2(B) R24.2 R26.1
NetQ3_2: Q3.2(B) R29.2 R31.1
NetQ4_2: Q4.2(B) R30.2 R32.1

### Notes on the sheet
- Title
- Size:
- Date:
- A4
- Number:
- Time:
- Revision:
- Sheet
- of
- File:

### Library data of the parts
Q1-Q4 = Transistor NPN: NPN Bipolar Transistor

## Sheet GPI_IF.SchDoc
size A4; SheetNumber: 2; SheetTotal: 13
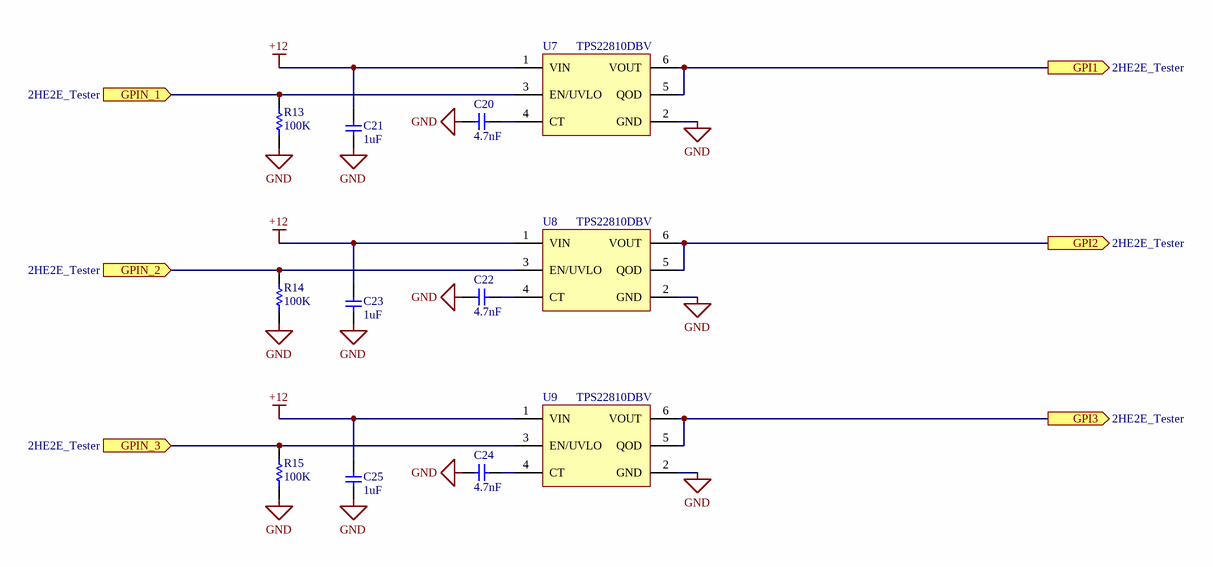
[diagram p6: GPI_IF.SchDoc]

### Parts
C20  value 4.7nF  [0603M-C]  (hidden comment: Cap Ceramic)
C21  value 1uF  [0603M-C]  (hidden comment: Cap Ceramic)
C22  value 4.7nF  [0603M-C]  (hidden comment: Cap Ceramic)
C23  value 1uF  [0603M-C]  (hidden comment: Cap Ceramic)
C24  value 4.7nF  [0603M-C]  (hidden comment: Cap Ceramic)
C25  value 1uF  [0603M-C]  (hidden comment: Cap Ceramic)
R13  value 100K  [0603M]  (hidden comment: Resistor)
R14  value 100K  [0603M]  (hidden comment: Resistor)
R15  value 100K  [0603M]  (hidden comment: Resistor)
U7  TPS22810DBV  [SOT23-6 (SOT26)]
U8  TPS22810DBV  [SOT23-6 (SOT26)]
U9  TPS22810DBV  [SOT23-6 (SOT26)]

### Ports
GPI1 (out, see 2HE2E_Tester), GPI2 (out, see 2HE2E_Tester), GPI3 (out, see 2HE2E_Tester), GPIN_1 (in, see 2HE2E_Tester), GPIN_2 (in, see 2HE2E_Tester), GPIN_3 (in, see 2HE2E_Tester)

### Nets
+12: C21.1 C23.1 C25.1 U7.1(VIN) U8.1(VIN) U9.1(VIN)
GND: C20.2 C21.2 C22.2 C23.2 C24.2 C25.2 R13.1 R14.1 R15.1 U7.2(GND) U8.2(GND) U9.2(GND)
GPI1: U7.5(QOD) U7.6(VOUT) ; port GPI1
GPI2: U8.5(QOD) U8.6(VOUT) ; port GPI2
GPI3: U9.5(QOD) U9.6(VOUT) ; port GPI3
GPIN_1: R13.2 U7.3(EN/UVLO) ; port GPIN_1
GPIN_2: R14.2 U8.3(EN/UVLO) ; port GPIN_2
GPIN_3: R15.2 U9.3(EN/UVLO) ; port GPIN_3
NetC20_1: C20.1 U7.4(CT)
NetC22_1: C22.1 U8.4(CT)
NetC24_1: C24.1 U9.4(CT)

### Notes on the sheet
- Title
- Size:
- Date:
- A4
- Number:
- Time:
- Revision:
- Sheet
- of
- File:

### Library data of the parts
C20 C22 C24 = Cap Ceramic: Ceramic Capacitor
C21 C23 C25 = Cap Ceramic: Ceramic Capacitor 16V
U7-U9 = TPS22810DBV: Load Switch With Thermal Protection 2.7-18-V, 79-mΩ On-Resistance

## Sheet DCDC_AP62600_5V.SchDoc: Input Switching 5V
size A4; DrawnBy: Marini; DocumentNumber: 2HSGB; Revision: 1.1; SheetNumber: 3; SheetTotal: 13
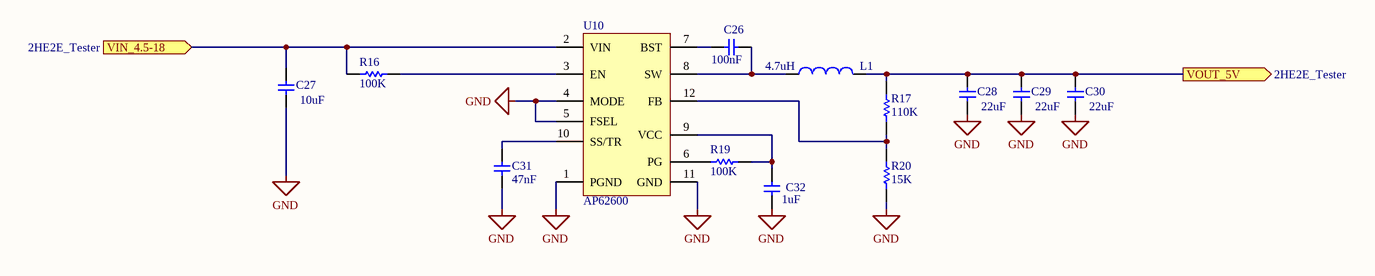
[diagram p7: DCDC_AP62600_5V.SchDoc]

### Parts
C26  value 100nF  [0603M-C]  (hidden comment: Cap Ceramic)
C27  value 10uF  [0603M]  (hidden comment: Cap Ceramic)
C28  value 22uF  [0603M]  (hidden comment: Cap Ceramic)
C29  value 22uF  [0603M]  (hidden comment: Cap Ceramic)
C30  value 22uF  [0603M]  (hidden comment: Cap Ceramic)
C31  value 47nF  [0603M]  (hidden comment: Cap Ceramic)
C32  value 1uF  [0603M-C]  (hidden comment: Cap Ceramic)
L1  value 4.7uH  [WE-LQSH_4020]  (hidden comment: Induttanza)
R16  value 100K  [0603M]  (hidden comment: Resistor)
R17  value 110K  [0603M]  (hidden comment: Resistor)
R19  value 100K  [0603M]  (hidden comment: Resistor)
R20  value 15K  [0603M]  (hidden comment: Resistor)
U10  AP62600  [VQFN2030-12(Type A)]

### Ports
VIN_4.5-18 (in, see 2HE2E_Tester), VOUT_5V (out, see 2HE2E_Tester)

### Nets
+5: C28.2 C29.2 C30.2 L1.2 R17.2 ; port VOUT_5V
+12: C27.2 R16.1 U10.2(VIN) ; port VIN_4.5-18
GND: C27.1 C28.1 C29.1 C30.1 C31.1 C32.1 R20.1 U10.1(PGND) U10.4(MODE) U10.5(FSEL) U10.11(GND)
NetC26_1: C26.1 U10.7(BST)
NetC26_2: C26.2 L1.1 U10.8(SW)
NetC31_2: C31.2 U10.10(SS/TR)
NetC32_2: C32.2 R19.2 U10.9(VCC)
NetR16_2: R16.2 U10.3(EN)
NetR17_1: R17.1 R20.2 U10.12(FB)
NetR19_1: R19.1 U10.6(PG)

### Library data of the parts
C26 = Cap Ceramic: Ceramic Capacitor
C27 C32 = Cap Ceramic: Ceramic Capacitor 16V
C28-C30 = Cap Ceramic: Ceramic Capacitor 10V
C31 = Cap Ceramic: Ceramic Capacitor 50V
L1 = Induttanza: 74405042047 WE-LQSH SMT High Saturation Power Inductor
U10 = AP62600: 4.5V TO 18VINPUT, 6A SYNCHRONOUS BUCK CONVERTER

## Sheet CAN_Switch.SchDoc
size A4; SheetNumber: 8; SheetTotal: 13
Used 2 times, as channels U_CAN0_Switch, U_CAN1_Switch. Parts and nets are listed once, with the designators drawn on the sheet.
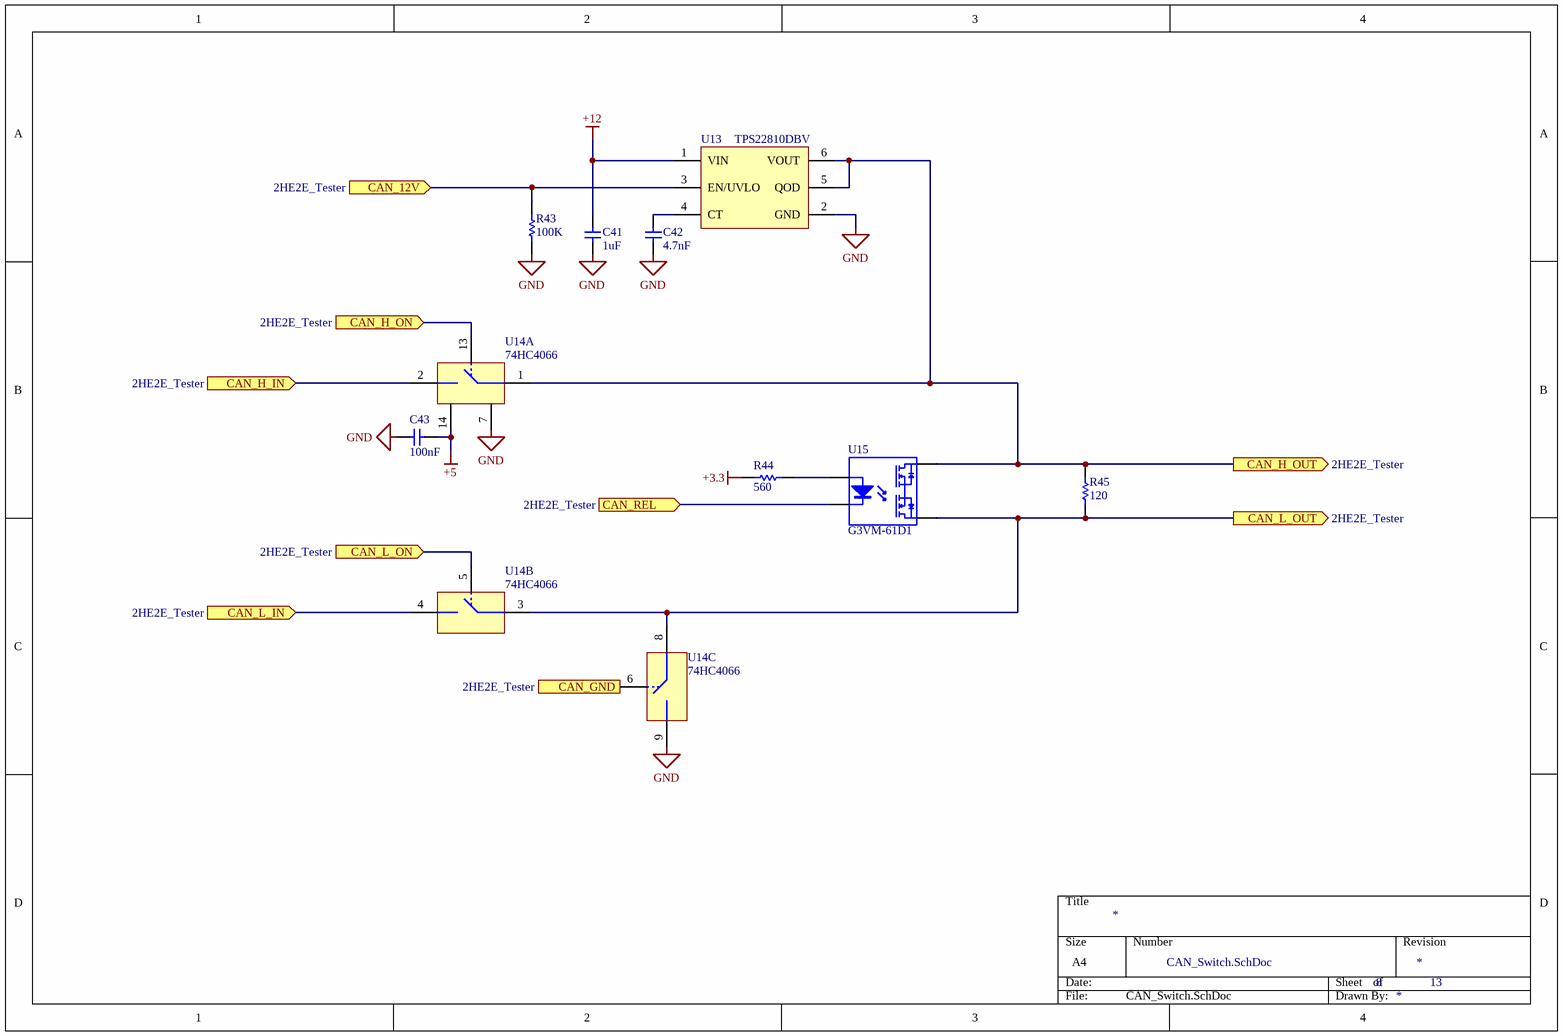
[diagram p8: CAN_Switch.SchDoc]

### Parts
C41  value 1uF  [0603M-C]  (hidden comment: Cap Ceramic)
C42  value 4.7nF  [0603M-C]  (hidden comment: Cap Ceramic)
C43  value 100nF  [0603M-C]  (hidden comment: Cap Ceramic)
R43  value 100K  [0603M]  (hidden comment: Resistor)
R44  value 560  [0603M]  (hidden comment: Resistor)
R45  value 120  [0603M]  (hidden comment: Resistor)
U13  TPS22810DBV  [SOT23-6 (SOT26)]
U14  74HC4066  [SOIC127P600X175-14N-Medium Density]  (parts A,B,C of 4)
U15  G3VM-61D1  [G3VM-351D]

### Ports
CAN_12V (in, see 2HE2E_Tester), CAN_GND (in, see 2HE2E_Tester), CAN_H_IN (in, see 2HE2E_Tester), CAN_H_ON (in, see 2HE2E_Tester), CAN_H_OUT (out, see 2HE2E_Tester), CAN_L_IN (in, see 2HE2E_Tester), CAN_L_ON (in, see 2HE2E_Tester), CAN_L_OUT (out, see 2HE2E_Tester), CAN_REL (in, see 2HE2E_Tester)

### Nets
+3.3: R44.2
+5: C43.2 U14.14(VCC)
+12: C41.1 U13.1(VIN)
GND: C41.2 C42.2 C43.1 R43.1 U13.2(GND) U14.7(GND) U14.9
CAN_12V: R43.2 U13.3(EN/UVLO) ; port CAN_12V
CAN_GND: U14.6 ; port CAN_GND
CAN_H_IN: U14.2 ; port CAN_H_IN
CAN_H_ON: U14.13 ; port CAN_H_ON
CAN_H_OUT: R45.2 U13.5(QOD) U13.6(VOUT) U14.1 U15.4(MOS+) ; port CAN_H_OUT
CAN_L_IN: U14.4 ; port CAN_L_IN
CAN_L_ON: U14.5 ; port CAN_L_ON
CAN_L_OUT: R45.1 U14.3 U14.8 U15.3(MOS-) ; port CAN_L_OUT
CAN_REL: U15.2(K) ; port CAN_REL
NetC42_1: C42.1 U13.4(CT)
NetR44_1: R44.1 U15.1(A)

### Channels
U_CAN0_Switch: designators end in _1; ports CAN_12V=CAN_12V_0 CAN_GND=CAN_GND_0 CAN_H_IN=NetC38_1_2 CAN_H_ON=CAN_H_ON_0 CAN_H_OUT=TEST_CAN0_H CAN_L_IN=NetC37_1_2 CAN_L_ON=CAN_L_ON_0 CAN_L_OUT=TEST_CAN0_L CAN_REL=CAN_REL_0
U_CAN1_Switch: designators end in _2; ports CAN_12V=CAN_12V_1 CAN_GND=CAN_GND_1 CAN_H_IN=NetC38_2_2 CAN_H_ON=CAN_H_ON_1 CAN_H_OUT=TEST_CAN1_H CAN_L_IN=NetC37_2_2 CAN_L_ON=CAN_L_ON_1 CAN_L_OUT=TEST_CAN1_L CAN_REL=CAN_REL_1

### Notes on the sheet
- Title
- Size:
- Date:
- A4
- Number:
- Time:
- Revision:
- Sheet
- of
- File:

### Library data of the parts
C41 = Cap Ceramic: Ceramic Capacitor 16V
C42 C43 = Cap Ceramic: Ceramic Capacitor
U13 = TPS22810DBV: as U7 on sheet GPI_IF
U14 = 74HC4066: Quad bilateral switch
U15 = FotoMOS: FotoMOS FET Relays

## Sheet R7FA4M3AF3CFB.SchDoc
size A3; SheetNumber: 9; SheetTotal: 13
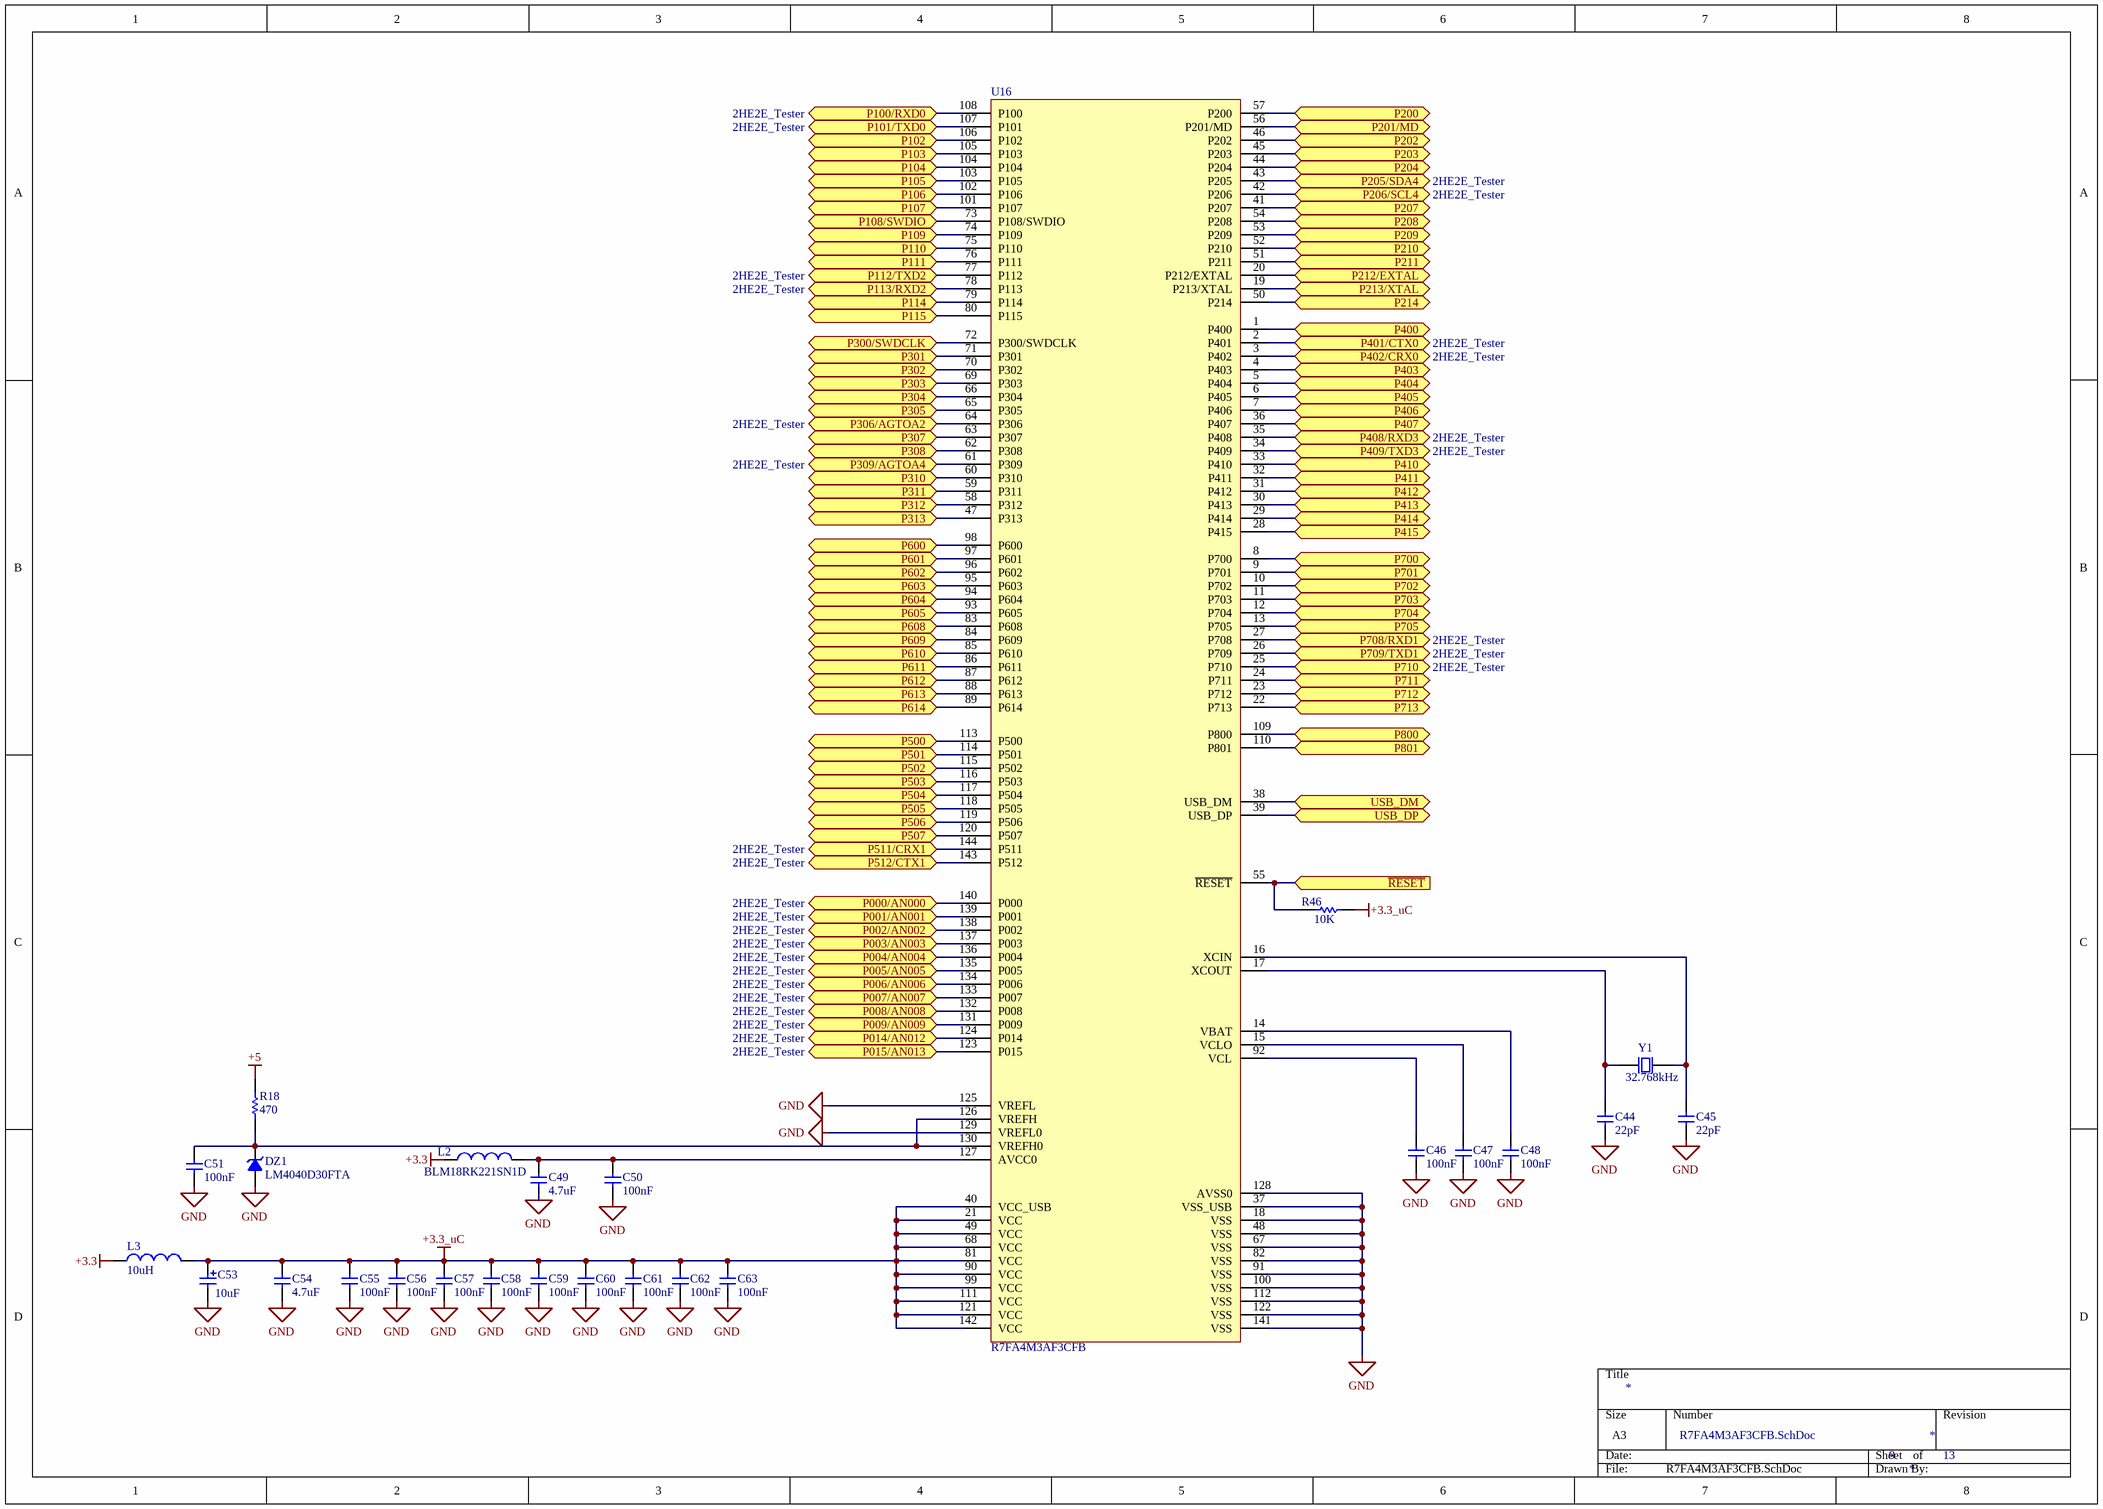
[diagram p9: R7FA4M3AF3CFB.SchDoc]

### Parts
C44  value 22pF  [0603M-C]  (hidden comment: Cap Ceramic)
C45  value 22pF  [0603M-C]  (hidden comment: Cap Ceramic)
C46  value 100nF  [0603M-C]  (hidden comment: Cap Ceramic)
C47  value 100nF  [0603M-C]  (hidden comment: Cap Ceramic)
C48  value 100nF  [0603M-C]  (hidden comment: Cap Ceramic)
C49  value 4.7uF  [0603M-C]  (hidden comment: Cap Ceramic)
C50  value 100nF  [0603M-C]  (hidden comment: Cap Ceramic)
C51  value 100nF  [0603M-C]  (hidden comment: Cap Ceramic)
C53  value 10uF  [Cap CASE A]  (hidden comment: Cap Tantalio)
C54  value 4.7uF  [0603M-C]  (hidden comment: Cap Ceramic)
C55  value 100nF  [0603M-C]  (hidden comment: Cap Ceramic)
C56  value 100nF  [0603M-C]  (hidden comment: Cap Ceramic)
C57  value 100nF  [0603M-C]  (hidden comment: Cap Ceramic)
C58  value 100nF  [0603M-C]  (hidden comment: Cap Ceramic)
C59  value 100nF  [0603M-C]  (hidden comment: Cap Ceramic)
C60  value 100nF  [0603M-C]  (hidden comment: Cap Ceramic)
C61  value 100nF  [0603M-C]  (hidden comment: Cap Ceramic)
C62  value 100nF  [0603M-C]  (hidden comment: Cap Ceramic)
C63  value 100nF  [0603M-C]  (hidden comment: Cap Ceramic)
DZ1  LM4040D30FTA  [SOT23 ZR4040]
L2  BLM18RK221SN1D  [0603M]
L3  value 10uH  [1210ML]  (hidden comment: Induttanza)
R18  value 470  [0603M]  (hidden comment: Resistor)
R46  value 10K  [0603M]  (hidden comment: Resistor)
U16  R7FA4M3AF3CFB  [TQFP50P2200X2200X170-144N]
Y1  32.768kHz  [WE-XTAL_CFPX-217]

### Ports
P000/AN000 (bidir, see 2HE2E_Tester), P001/AN001 (bidir, see 2HE2E_Tester), P002/AN002 (bidir, see 2HE2E_Tester), P003/AN003 (bidir, see 2HE2E_Tester), P004/AN004 (bidir, see 2HE2E_Tester), P005/AN005 (bidir, see 2HE2E_Tester), P006/AN006 (bidir, see 2HE2E_Tester), P007/AN007 (bidir, see 2HE2E_Tester), P008/AN008 (bidir, see 2HE2E_Tester), P009/AN009 (bidir, see 2HE2E_Tester), P014/AN012 (bidir, see 2HE2E_Tester), P015/AN013 (bidir, see 2HE2E_Tester), P100/RXD0 (bidir, see 2HE2E_Tester), P101/TXD0 (bidir, see 2HE2E_Tester), P102 (bidir, see 2HE2E_Tester), P103 (bidir, see 2HE2E_Tester), P104 (bidir, see 2HE2E_Tester), P105 (bidir, see 2HE2E_Tester), P106 (bidir, see 2HE2E_Tester), P107 (bidir, see 2HE2E_Tester), P108/SWDIO (bidir, see 2HE2E_Tester), P109 (bidir, see 2HE2E_Tester), P110 (bidir, see 2HE2E_Tester), P111 (bidir, see 2HE2E_Tester), P112/TXD2 (bidir, see 2HE2E_Tester), P113/RXD2 (bidir, see 2HE2E_Tester), P114 (bidir, see 2HE2E_Tester), P115 (bidir, see 2HE2E_Tester), P200 (bidir, see 2HE2E_Tester), P201/MD (bidir, see 2HE2E_Tester), P202 (bidir, see 2HE2E_Tester), P203 (bidir, see 2HE2E_Tester), P204 (bidir, see 2HE2E_Tester), P205/SDA4 (bidir, see 2HE2E_Tester), P206/SCL4 (bidir, see 2HE2E_Tester), P207 (bidir, see 2HE2E_Tester), P208 (bidir, see 2HE2E_Tester), P209 (bidir, see 2HE2E_Tester), P210 (bidir, see 2HE2E_Tester), P211 (bidir, see 2HE2E_Tester), P212/EXTAL (bidir, see 2HE2E_Tester), P213/XTAL (bidir, see 2HE2E_Tester), P214 (bidir, see 2HE2E_Tester), P300/SWDCLK (bidir, see 2HE2E_Tester), P301 (bidir, see 2HE2E_Tester), P302 (bidir, see 2HE2E_Tester), P303 (bidir, see 2HE2E_Tester), P304 (bidir, see 2HE2E_Tester), P305 (bidir, see 2HE2E_Tester), P306/AGTOA2 (bidir, see 2HE2E_Tester), P307 (bidir, see 2HE2E_Tester), P308 (bidir, see 2HE2E_Tester), P309/AGTOA4 (bidir, see 2HE2E_Tester), P310 (bidir, see 2HE2E_Tester), P311 (bidir, see 2HE2E_Tester), P312 (bidir, see 2HE2E_Tester), P313 (bidir, see 2HE2E_Tester), P400 (bidir, see 2HE2E_Tester), P401/CTX0 (bidir, see 2HE2E_Tester), P402/CRX0 (bidir, see 2HE2E_Tester), P403 (bidir, see 2HE2E_Tester), P404 (bidir, see 2HE2E_Tester), P405 (bidir, see 2HE2E_Tester), P406 (bidir, see 2HE2E_Tester), P407 (bidir, see 2HE2E_Tester), P408/RXD3 (bidir, see 2HE2E_Tester), P409/TXD3 (bidir, see 2HE2E_Tester), P410 (bidir, see 2HE2E_Tester), P411 (bidir, see 2HE2E_Tester), P412 (bidir, see 2HE2E_Tester), P413 (bidir, see 2HE2E_Tester), P414 (bidir, see 2HE2E_Tester), P415 (bidir, see 2HE2E_Tester), P500 (bidir, see 2HE2E_Tester), P501 (bidir, see 2HE2E_Tester), P502 (bidir, see 2HE2E_Tester), P503 (bidir, see 2HE2E_Tester), P504 (bidir, see 2HE2E_Tester), P505 (bidir, see 2HE2E_Tester), P506 (bidir, see 2HE2E_Tester), P507 (bidir, see 2HE2E_Tester), P511/CRX1 (bidir, see 2HE2E_Tester), P512/CTX1 (bidir, see 2HE2E_Tester), P600 (bidir, see 2HE2E_Tester), P601 (bidir, see 2HE2E_Tester), P602 (bidir, see 2HE2E_Tester), P603 (bidir, see 2HE2E_Tester), P604 (bidir, see 2HE2E_Tester), P605 (bidir, see 2HE2E_Tester), P608 (bidir, see 2HE2E_Tester), P609 (bidir, see 2HE2E_Tester), P610 (bidir, see 2HE2E_Tester), P611 (bidir, see 2HE2E_Tester), P612 (bidir, see 2HE2E_Tester), P613 (bidir, see 2HE2E_Tester), P614 (bidir, see 2HE2E_Tester), P700 (bidir, see 2HE2E_Tester), P701 (bidir, see 2HE2E_Tester), P702 (bidir, see 2HE2E_Tester), P703 (bidir, see 2HE2E_Tester), P704 (bidir, see 2HE2E_Tester), P705 (bidir, see 2HE2E_Tester), P708/RXD1 (bidir, see 2HE2E_Tester), P709/TXD1 (bidir, see 2HE2E_Tester), P710 (bidir, see 2HE2E_Tester), P711 (bidir, see 2HE2E_Tester), P712 (bidir, see 2HE2E_Tester), P713 (bidir, see 2HE2E_Tester), P800 (bidir, see 2HE2E_Tester), P801 (bidir, see 2HE2E_Tester), USB_DM (bidir, see 2HE2E_Tester), USB_DP (bidir, see 2HE2E_Tester), ~{RESET} (in, see 2HE2E_Tester)

### Nets
+3.3: L2.1 L3.1
+3.3_uC: C53.1 C54.2 C55.2 C56.2 C57.2 C58.2 C59.2 C60.2 C61.2 C62.2 C63.2 L3.2 R46.1 U16.21(VCC) U16.40(VCC_USB) U16.49(VCC) U16.68(VCC) U16.81(VCC) U16.90(VCC) U16.99(VCC) U16.111(VCC) U16.121(VCC) U16.142(VCC)
+5: R18.2
GND: C44.1 C45.1 C46.1 C47.1 C48.1 C49.1 C50.1 C51.1 C53.2 C54.1 C55.1 C56.1 C57.1 C58.1 C59.1 C60.1 C61.1 C62.1 C63.1 DZ1.1(A) U16.18(VSS) U16.37(VSS_USB) U16.48(VSS) U16.67(VSS) U16.82(VSS) U16.91(VSS) U16.100(VSS) U16.112(VSS) U16.122(VSS) U16.125(VREFL) U16.128(AVSS0) U16.129(VREFL0) U16.141(VSS)
2HBM2_DISB: U16.63(P307) ; port P307
2HBM2_IOUT: U16.135(P005) ; port P005/AN005
2HBM2_PWM: U16.64(P306) ; port P306/AGTOA2
2HBM2_VOUT: U16.136(P004) ; port P004/AN004
AIN_GPO1: U16.140(P000) ; port P000/AN000
AIN_GPO2: U16.139(P001) ; port P001/AN001
AIN_GPO3: U16.138(P002) ; port P002/AN002
ANT_GPS: U16.51(P211) ; port P211
ANT_LTE_DIV: U16.52(P210) ; port P210
ANT_LTE_MAIN: U16.53(P209) ; port P209
BAT_CHG_I: U16.133(P007) ; port P007/AN007
BAT_CHG_V: U16.134(P006) ; port P006/AN006
BAT_EMU_DIS: U16.89(P614) ; port P614
BAT_EMU_I: U16.123(P015) ; port P015/AN013
BAT_EMU_V: U16.124(P014) ; port P014/AN012
BAT_EN_EMU: U16.88(P613) ; port P613
BAT_EN_MON: U16.87(P612) ; port P612
BAT_MON_I: U16.131(P009) ; port P009/AN009
BAT_MON_V: U16.132(P008) ; port P008/AN008
BS_DEBUG_RX: U16.26(P709) ; port P709/TXD1
BS_DEBUG_TX: U16.27(P708) ; port P708/RXD1
BTN_DOWN: U16.9(P701) ; port P701
BTN_ESC: U16.13(P705) ; port P705
BTN_LEFT: U16.10(P702) ; port P702
BTN_OK: U16.12(P704) ; port P704
BTN_RIGHT: U16.11(P703) ; port P703
BTN_UP: U16.8(P700) ; port P700
CAN0_RX: U16.3(P402) ; port P402/CRX0
CAN0_TX: U16.2(P401) ; port P401/CTX0
CAN1_RX: U16.143(P512) ; port P512/CTX1
CAN1_TX: U16.144(P511) ; port P511/CRX1
CAN_12V_0: U16.96(P602) ; port P602
CAN_12V_1: U16.84(P609) ; port P609
CAN_GND_0: U16.95(P603) ; port P603
CAN_GND_1: U16.85(P610) ; port P610
CAN_H_ON_0: U16.98(P600) ; port P600
CAN_H_ON_1: U16.93(P605) ; port P605
CAN_L_ON_0: U16.97(P601) ; port P601
CAN_L_ON_1: U16.83(P608) ; port P608
CAN_REL_0: U16.94(P604) ; port P604
CAN_REL_1: U16.86(P611) ; port P611
DISP_SCL: U16.42(P206) ; port P206/SCL4
DISP_SDA: U16.43(P205) ; port P205/SDA4
HW_DEBUG_RX: U16.34(P409) ; port P409/TXD3
HW_DEBUG_TX: U16.35(P408) ; port P408/RXD3
~{RESET}: R46.2 U16.55(~{RESET}) ; port ~{RESET}
RASP_DISB: U16.60(P310) ; port P310
RASP_EVENT_IN: U16.23(P712) ; port P712
RASP_EVENT_OUT: U16.22(P713) ; port P713
RASP_PWM: U16.61(P309) ; port P309/AGTOA4
RASP_RX: U16.108(P100) ; port P100/RXD0
RASP_TX: U16.107(P101) ; port P101/TXD0
RASP_VOUT: U16.137(P003) ; port P003/AN003
REL_IN_1: U16.4(P403) ; port P403
REL_IN_2: U16.5(P404) ; port P404
REL_IN_3: U16.6(P405) ; port P405
REL_IN_4: U16.7(P406) ; port P406
SWDCLK: U16.72(P300/SWDCLK) ; port P300/SWDCLK
SWDIO: U16.73(P108/SWDIO) ; port P108/SWDIO
TEST_485_DIR: U16.76(P111) ; port P111
TEST_485_RX: U16.78(P113) ; port P113/RXD2
TEST_485_TX: U16.77(P112) ; port P112/TXD2
USB_DATA_EN: U16.70(P302) ; port P302
USB_VBUS_EN: U16.71(P301) ; port P301
NetC44_2: C44.2 U16.17(XCOUT) Y1.2
NetC45_2: C45.2 U16.16(XCIN) Y1.1
NetC46_2: C46.2 U16.92(VCL)
NetC47_2: C47.2 U16.15(VCLO)
NetC48_2: C48.2 U16.14(VBAT)
NetC49_2: C49.2 C50.2 L2.2 U16.127(AVCC0)
NetC51_2: C51.2 DZ1.2(K) R18.1 U16.126(VREFH) U16.130(VREFH0)
NetU16_1: U16.1(P400) ; port P400
NetU16_19: U16.19(P213/XTAL) ; port P213/XTAL
NetU16_20: U16.20(P212/EXTAL) ; port P212/EXTAL
NetU16_24: U16.24(P711) ; port P711
NetU16_25: U16.25(P710) ; port P710
NetU16_28: U16.28(P415) ; port P415
NetU16_29: U16.29(P414) ; port P414
NetU16_30: U16.30(P413) ; port P413
NetU16_31: U16.31(P412) ; port P412
NetU16_32: U16.32(P411) ; port P411
NetU16_33: U16.33(P410) ; port P410
NetU16_36: U16.36(P407) ; port P407
NetU16_38: U16.38(USB_DM) ; port USB_DM
NetU16_39: U16.39(USB_DP) ; port USB_DP
NetU16_41: U16.41(P207) ; port P207
NetU16_44: U16.44(P204) ; port P204
NetU16_45: U16.45(P203) ; port P203
NetU16_46: U16.46(P202) ; port P202
NetU16_47: U16.47(P313) ; port P313
NetU16_50: U16.50(P214) ; port P214
NetU16_54: U16.54(P208) ; port P208
NetU16_56: U16.56(P201/MD) ; port P201/MD
NetU16_57: U16.57(P200) ; port P200
NetU16_58: U16.58(P312) ; port P312
NetU16_59: U16.59(P311) ; port P311
NetU16_62: U16.62(P308) ; port P308
NetU16_65: U16.65(P305) ; port P305
NetU16_66: U16.66(P304) ; port P304
NetU16_69: U16.69(P303) ; port P303
NetU16_74: U16.74(P109) ; port P109
NetU16_75: U16.75(P110) ; port P110
NetU16_79: U16.79(P114) ; port P114
NetU16_80: U16.80(P115) ; port P115
NetU16_101: U16.101(P107) ; port P107
NetU16_102: U16.102(P106) ; port P106
NetU16_103: U16.103(P105) ; port P105
NetU16_104: U16.104(P104) ; port P104
NetU16_105: U16.105(P103) ; port P103
NetU16_106: U16.106(P102) ; port P102
NetU16_109: U16.109(P800) ; port P800
NetU16_110: U16.110(P801) ; port P801
NetU16_113: U16.113(P500) ; port P500
NetU16_114: U16.114(P501) ; port P501
NetU16_115: U16.115(P502) ; port P502
NetU16_116: U16.116(P503) ; port P503
NetU16_117: U16.117(P504) ; port P504
NetU16_118: U16.118(P505) ; port P505
NetU16_119: U16.119(P506) ; port P506
NetU16_120: U16.120(P507) ; port P507

### Notes on the sheet
- Title
- Size:
- Date:
- A4
- Number:
- Time:
- Revision:
- Sheet
- of
- File:

### Library data of the parts
C44 C45 = Cap Ceramic: Ceramic Capacitor
C46-C48 C50 C51 C55-C63 = Cap Ceramic: Ceramic Capacitor 25V
C49 C54 = Cap Ceramic: Ceramic Capacitor 6.3V
C53 = Cap Tantalio: Capacitor tantalio 10V
DZ1 = Diodo Zener: Reference 3V
L2 = Induttanza: Ferrite Bead; Value: 220@100MHz
L3 = Induttanza: WE 744032100
U16 = R7FA4M3Ax3CFB: RA4M3 100 MHz Arm Cortex-M33 core 144 pin
Y1 = Quarzo: WE-XTAL  830108488401- Watch Crystals  32.768kHz ±20ppm 12.5pF

## Sheet Raspberry_Pwr.SchDoc
size A3; SheetNumber: 10; SheetTotal: 13
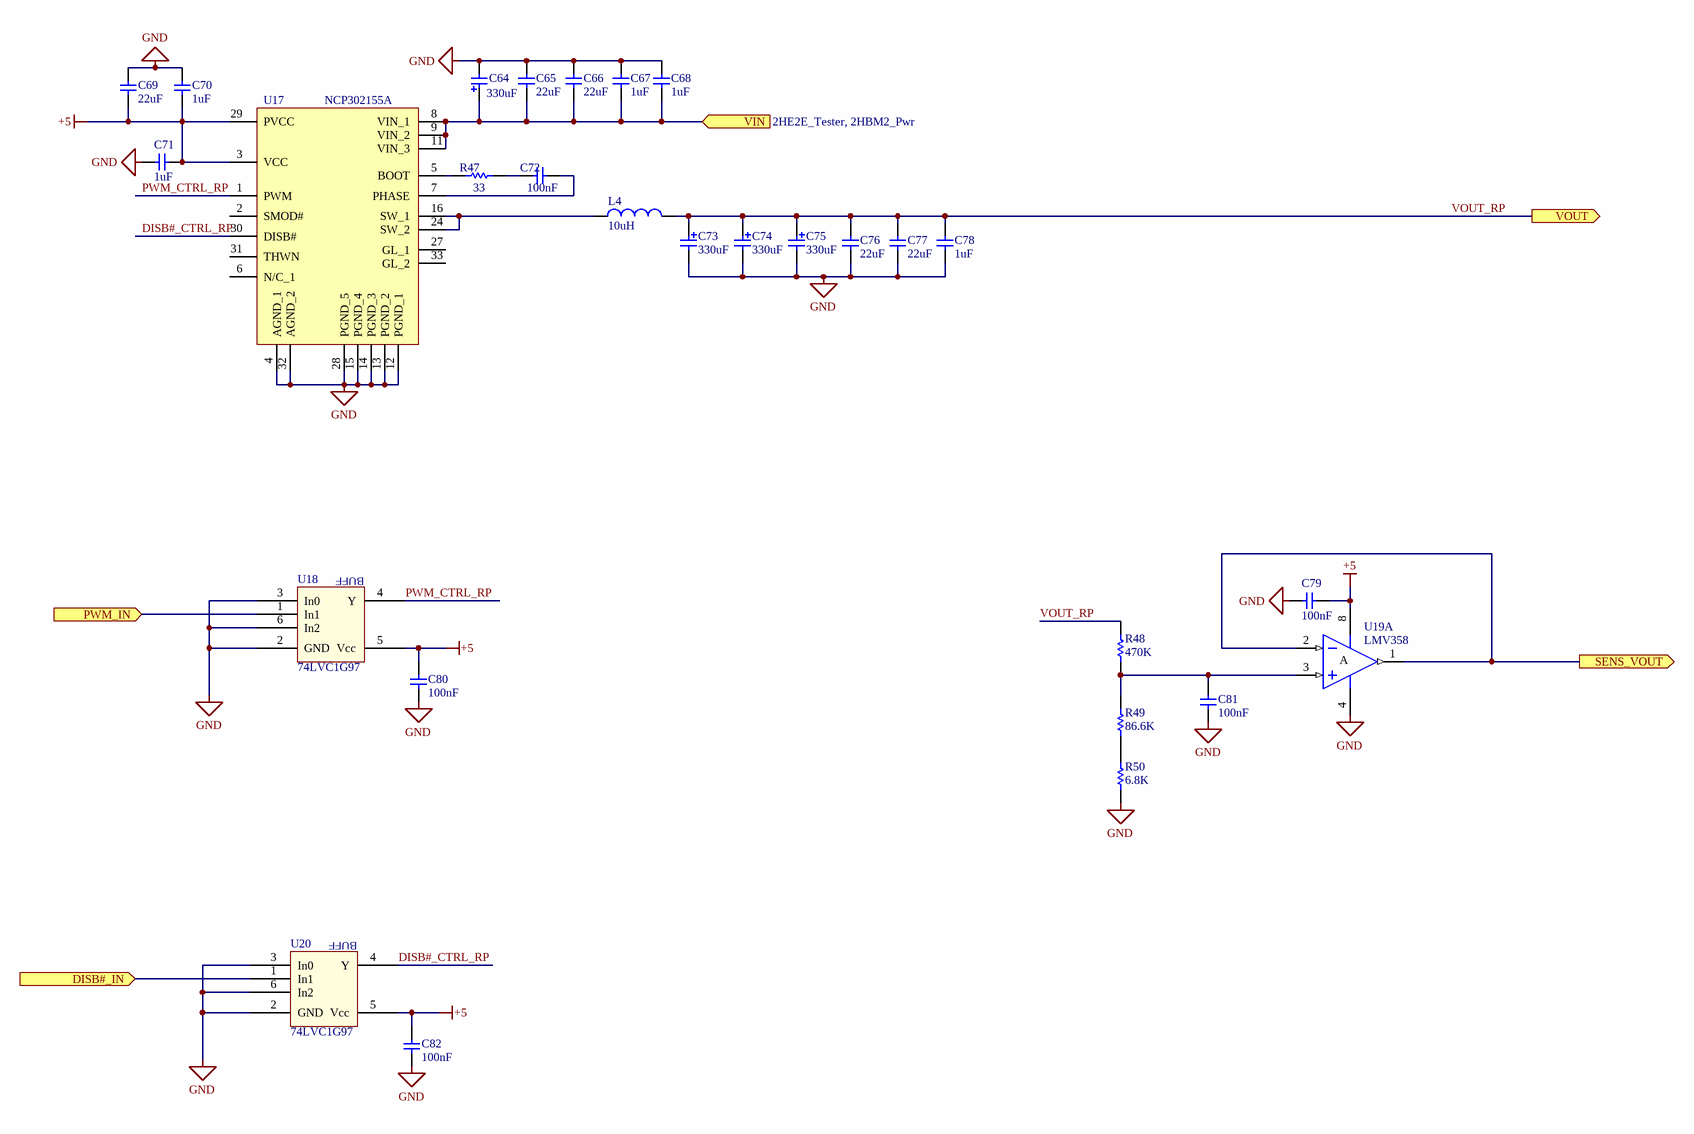
[diagram p10: Raspberry_Pwr.SchDoc]

### Parts
C64  value 330uF  [Cap Elet SMD 8.0 mm CASE E-h6.5mm]  (hidden comment: Cap Elettrolitico)
C65  value 22uF  [1206M]  (hidden comment: Cap Ceramic)
C66  value 22uF  [1206M]  (hidden comment: Cap Ceramic)
C67  value 1uF  [1206M]  (hidden comment: Cap Ceramic)
C68  value 1uF  [1206M]  (hidden comment: Cap Ceramic)
C69  value 22uF  [1206M]  (hidden comment: Cap Ceramic)
C70  value 1uF  [1206M]  (hidden comment: Cap Ceramic)
C71  value 1uF  [1206M]  (hidden comment: Cap Ceramic)
C72  value 100nF  [0603M-C]  (hidden comment: Cap Ceramic)
C73  value 330uF  [Cap Elet SMD 8.0 mm CASE E-h6.5mm]  (hidden comment: Cap Elettrolitico)
C74  value 330uF  [Cap Elet SMD 8.0 mm CASE E-h6.5mm]  (hidden comment: Cap Elettrolitico)
C75  value 330uF  [Cap Elet SMD 8.0 mm CASE E-h6.5mm]  (hidden comment: Cap Elettrolitico)
C76  value 22uF  [1206M]  (hidden comment: Cap Ceramic)
C77  value 22uF  [1206M]  (hidden comment: Cap Ceramic)
C78  value 1uF  [1206M]  (hidden comment: Cap Ceramic)
C79  value 100nF  [0603M]  (hidden comment: Cap Ceramic)
C80  value 100nF  [0603M]  (hidden comment: Cap Ceramic)
C81  value 100nF  [0603M]  (hidden comment: Cap Ceramic)
C82  value 100nF  [0603M]  (hidden comment: Cap Ceramic)
L4  value 10uH  [WE-HCC_1210]  (hidden comment: Induttanza)
R47  value 33  [0603M]  (hidden comment: Resistor)
R48  value 470K  [0603M]  (hidden comment: Resistor)
R49  value 86.6K  [0603M]  (hidden comment: Resistor)
R50  value 6.8K  [0603M]  (hidden comment: Resistor)
U17  NCP302155A  [NCP302155A]
U18  74LVC1G97  [TSOP65P211-6N]
U19  LMV358  [SOIC127P600-8N]  (part A of 2)
U20  74LVC1G97  [TSOP65P211-6N]

### Ports
DISB#_IN (in, see 2HE2E_Tester), PWM_IN (in, see 2HE2E_Tester), SENS_VOUT (out, see 2HE2E_Tester), VIN (in, see 2HE2E_Tester, 2HBM2_Pwr), VOUT (out, see 2HE2E_Tester)

### Nets
+5: C69.2 C70.1 C71.1 C79.2 C80.2 C82.2 U17.3(VCC) U17.29(PVCC) U18.5(Vcc) U19.8(V+) U20.5(Vcc)
+12: C64.1 C65.1 C66.1 C67.1 C68.1 U17.8(VIN_1) U17.9(VIN_2) U17.11(VIN_3) ; port VIN
GND: C64.2 C65.2 C66.2 C67.2 C68.2 C69.1 C70.2 C71.2 C73.2 C74.2 C75.2 C76.2 C77.2 C78.2 C79.1 C80.1 C81.1 C82.1 R50.1 U17.4(AGND_1) U17.12(PGND_1) U17.13(PGND_2) U17.14(PGND_3) U17.15(PGND_4) U17.28(PGND_5) U17.32(AGND_2) U18.2(GND) U18.3(In0) U18.6(In2) U19.4(GND) U20.2(GND) U20.3(In0) U20.6(In2)
VOUT_RP: C73.1 C74.1 C75.1 C76.1 C77.1 C78.1 L4.2 R48.2 ; port VOUT
DISB#_CTRL_RP: U17.30(DISB#) U20.4(Y)
PWM_CTRL_RP: U17.1(PWM) U18.4(Y)
RASP_DISB: U20.1(In1) ; port DISB#_IN
RASP_PWM: U18.1(In1) ; port PWM_IN
RASP_VOUT: U19.1(OUT) U19.2(IN-) ; port SENS_VOUT
NetC72_1: C72.1 R47.2
NetC72_2: C72.2 U17.7(PHASE)
NetC81_2: C81.2 R48.1 R49.2 U19.3(IN+)
NetL4_1: L4.1 U17.16(SW_1) U17.24(SW_2)
NetR47_1: R47.1 U17.5(BOOT)
NetR49_1: R49.1 R50.2

Not connected (* = marked no-connect by the designer): U17 2(SMOD#) 6(N/C_1) 27(GL_1) 31(THWN) 33(GL_2)

### Notes on the sheet
- (near U18) BUFF
- (near U20) BUFF
- Title
- Size:
- Date:
- A4
- Number:
- Time:
- Revision:
- Sheet
- of
- File:
- (in symbol LMV358, part A) A

### Library data of the parts
C64 C73-C75 = Cap Elettrolitico: Condensatore elettrolitico 35V D8
C65 C66 C69 C76 C77 C79-C82 = Cap Ceramic: Ceramic Capacitor 25V
C67 C68 C70 C71 C78 = Cap Ceramic: Ceramic Capacitor 50V
C72 = Cap Ceramic: Ceramic Capacitor
L4 = Induttanza: WE 7443321000
U17 = NCP302155A: Integrated Driver and MOSFET
U18 U20 = 74LVC1G97: Logic gate configurabile
U19 = LMV358: Dual Operational Amplifier Single Supply Rail to Rail; DatasheetDocument: Jan-1999; PackageDocument: Jul-1998; Publisher: Altium Limited; Code_JEDEC: MS-012-AA; Code_IPC: SO8; ComponentLink1Description: Manufacturer Link; ComponentLink1URL: http://www.st.com/; ComponentLink2Description: Datasheet; ComponentLink2URL: http://www.st.com/stonline/products/literature/ds/2300/tl082.pdf

## Sheet 2HBM2_Pwr.SchDoc
size A3; SheetNumber: 11; SheetTotal: 13
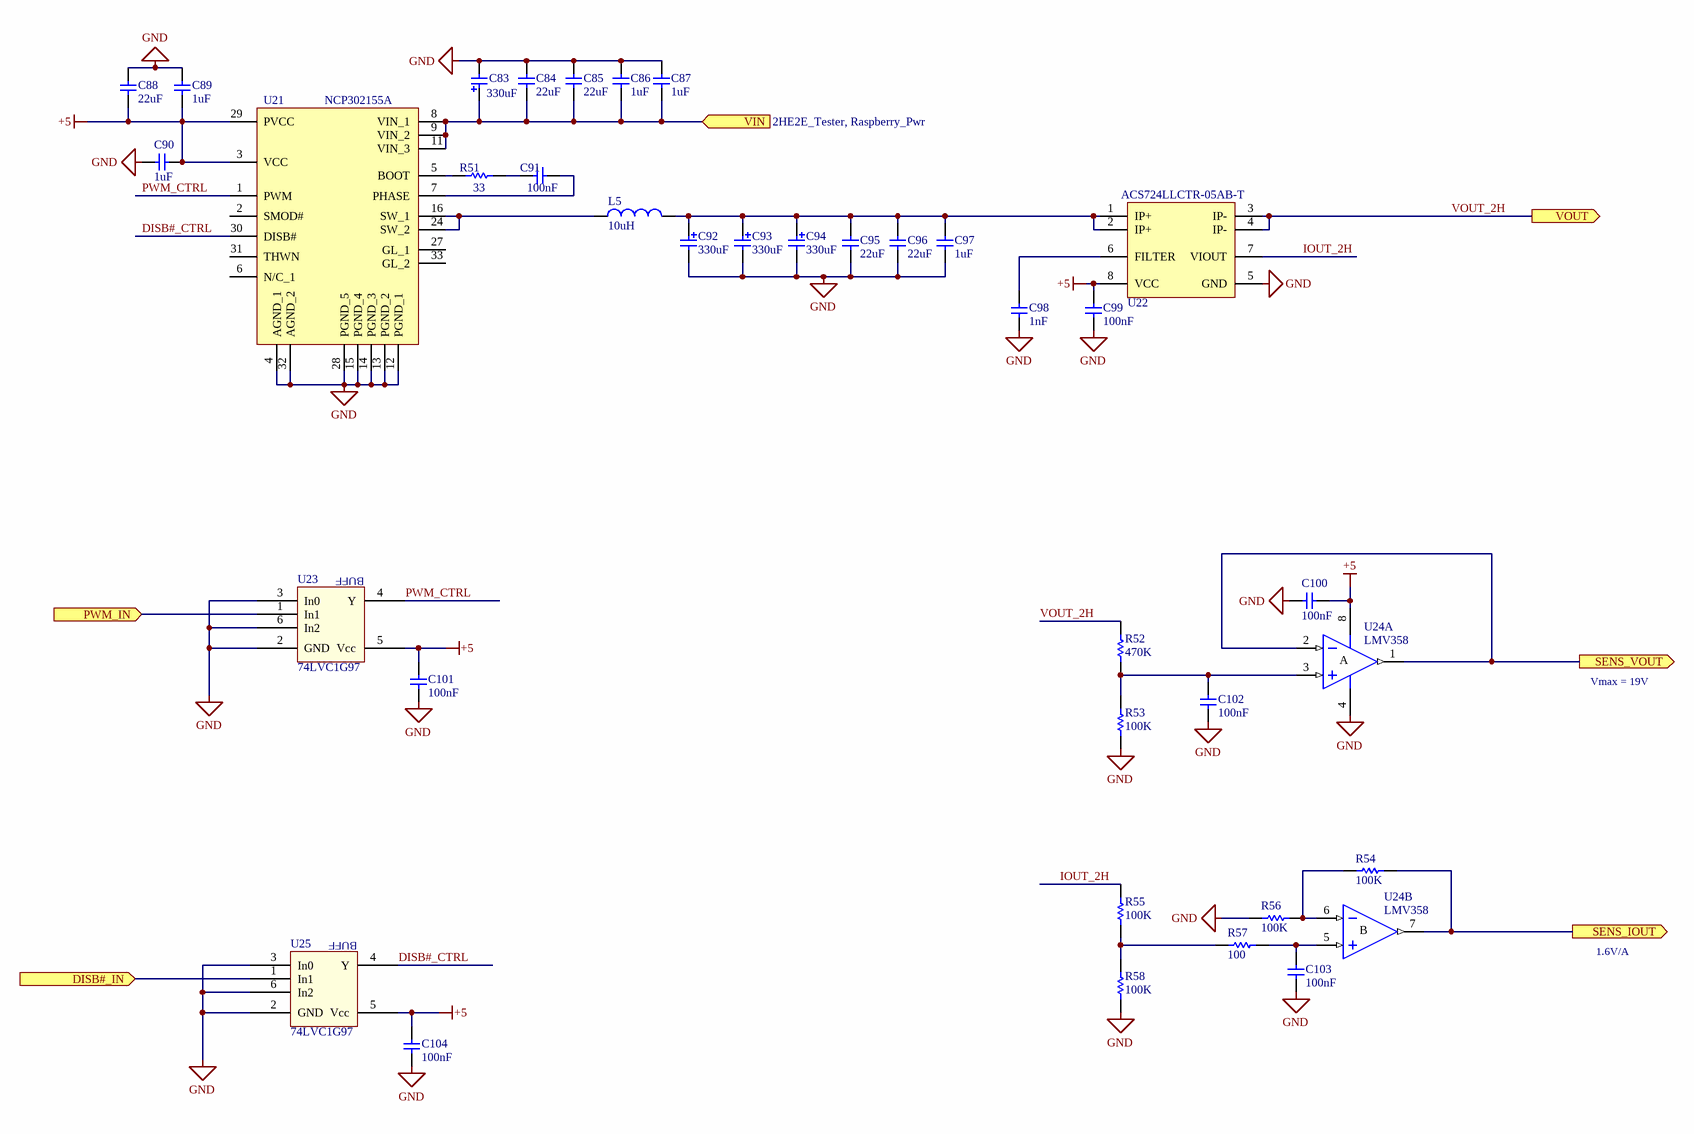
[diagram p11: 2HBM2_Pwr.SchDoc]

### Parts
C83  value 330uF  [Cap Elet SMD 8.0 mm CASE E-h6.5mm]  (hidden comment: Cap Elettrolitico)
C84  value 22uF  [1206M]  (hidden comment: Cap Ceramic)
C85  value 22uF  [1206M]  (hidden comment: Cap Ceramic)
C86  value 1uF  [1206M]  (hidden comment: Cap Ceramic)
C87  value 1uF  [1206M]  (hidden comment: Cap Ceramic)
C88  value 22uF  [1206M]  (hidden comment: Cap Ceramic)
C89  value 1uF  [1206M]  (hidden comment: Cap Ceramic)
C90  value 1uF  [1206M]  (hidden comment: Cap Ceramic)
C91  value 100nF  [0603M-C]  (hidden comment: Cap Ceramic)
C92  value 330uF  [Cap Elet SMD 8.0 mm CASE E-h6.5mm]  (hidden comment: Cap Elettrolitico)
C93  value 330uF  [Cap Elet SMD 8.0 mm CASE E-h6.5mm]  (hidden comment: Cap Elettrolitico)
C94  value 330uF  [Cap Elet SMD 8.0 mm CASE E-h6.5mm]  (hidden comment: Cap Elettrolitico)
C95  value 22uF  [1206M]  (hidden comment: Cap Ceramic)
C96  value 22uF  [1206M]  (hidden comment: Cap Ceramic)
C97  value 1uF  [1206M]  (hidden comment: Cap Ceramic)
C98  value 1nF  [0603M]  (hidden comment: Cap Ceramic)
C99  value 100nF  [0603M]  (hidden comment: Cap Ceramic)
C100  value 100nF  [0603M]  (hidden comment: Cap Ceramic)
C101  value 100nF  [0603M]  (hidden comment: Cap Ceramic)
C102  value 100nF  [0603M]  (hidden comment: Cap Ceramic)
C103  value 100nF  [0603M]  (hidden comment: Cap Ceramic)
C104  value 100nF  [0603M]  (hidden comment: Cap Ceramic)
L5  value 10uH  [WE-HCC_1210]  (hidden comment: Induttanza)
R51  value 33  [0603M]  (hidden comment: Resistor)
R52  value 470K  [0603M]  (hidden comment: Resistor)
R53  value 100K  [0603M]  (hidden comment: Resistor)
R54  value 100K  [0603M]  (hidden comment: Resistor)
R55  value 100K  [0603M]  (hidden comment: Resistor)
R56  value 100K  [0603M]  (hidden comment: Resistor)
R57  value 100  [0603M]  (hidden comment: Resistor)
R58  value 100K  [0603M]  (hidden comment: Resistor)
U21  NCP302155A  [NCP302155A]
U22  ACS724LLCTR-05AB-T  [SOIC127P600-8N]
U23  74LVC1G97  [TSOP65P211-6N]
U24  LMV358  [SOIC127P600-8N]  (parts A,B of 2)
U25  74LVC1G97  [TSOP65P211-6N]

### Ports
DISB#_IN (in, see 2HE2E_Tester), PWM_IN (in, see 2HE2E_Tester), SENS_IOUT (out, see 2HE2E_Tester), SENS_VOUT (out, see 2HE2E_Tester), VIN (in, see 2HE2E_Tester, Raspberry_Pwr), VOUT (out, see 2HE2E_Tester)

### Nets
+5: C88.2 C89.1 C90.1 C99.2 C100.2 C101.2 C104.2 U21.3(VCC) U21.29(PVCC) U22.8(VCC) U23.5(Vcc) U24.8(V+) U25.5(Vcc)
+12: C83.1 C84.1 C85.1 C86.1 C87.1 U21.8(VIN_1) U21.9(VIN_2) U21.11(VIN_3) ; port VIN
GND: C83.2 C84.2 C85.2 C86.2 C87.2 C88.1 C89.2 C90.2 C92.2 C93.2 C94.2 C95.2 C96.2 C97.2 C98.1 C99.1 C100.1 C101.1 C102.1 C103.1 C104.1 R53.1 R56.2 R58.2 U21.4(AGND_1) U21.12(PGND_1) U21.13(PGND_2) U21.14(PGND_3) U21.15(PGND_4) U21.28(PGND_5) U21.32(AGND_2) U22.5(GND) U23.2(GND) U23.3(In0) U23.6(In2) U24.4(GND) U25.2(GND) U25.3(In0) U25.6(In2)
VOUT_2H: R52.2 U22.3(IP-) U22.4(IP-) ; port VOUT
2HBM2_DISB: U25.1(In1) ; port DISB#_IN
2HBM2_IOUT: R54.1 U24.7(OUT) ; port SENS_IOUT
2HBM2_PWM: U23.1(In1) ; port PWM_IN
2HBM2_VOUT: U24.1(OUT) U24.2(IN-) ; port SENS_VOUT
DISB#_CTRL: U21.30(DISB#) U25.4(Y)
IOUT_2H: R55.1 U22.7(VIOUT)
PWM_CTRL: U21.1(PWM) U23.4(Y)
NetC91_1: C91.1 R51.2
NetC91_2: C91.2 U21.7(PHASE)
NetC92_1: C92.1 C93.1 C94.1 C95.1 C96.1 C97.1 L5.2 U22.1(IP+) U22.2(IP+)
NetC98_2: C98.2 U22.6(FILTER)
NetC102_2: C102.2 R52.1 R53.2 U24.3(IN+)
NetC103_2: C103.2 R57.1 U24.5(IN+)
NetL5_1: L5.1 U21.16(SW_1) U21.24(SW_2)
NetR51_1: R51.1 U21.5(BOOT)
NetR54_2: R54.2 R56.1 U24.6(IN-)
NetR55_2: R55.2 R57.2 R58.1

Not connected (* = marked no-connect by the designer): U21 2(SMOD#) 6(N/C_1) 27(GL_1) 31(THWN) 33(GL_2)

### Notes on the sheet
- (near U23) BUFF
- Vmax = 19V
- (near U25) BUFF
- 1.6V/A
- Title
- Size:
- Date:
- A4
- Number:
- Time:
- Revision:
- Sheet
- of
- File:
- (in symbol LMV358, part A) A
- (in symbol LMV358, part B) B

### Library data of the parts
C83 C92-C94 = Cap Elettrolitico: Condensatore elettrolitico 35V D8
C84 C85 C88 C95 C96 C98-C104 = Cap Ceramic: Ceramic Capacitor 25V
C86 C87 C89 C90 C97 = Cap Ceramic: Ceramic Capacitor 50V
C91 = Cap Ceramic: Ceramic Capacitor
L5 = Induttanza: WE 7443321000
U21 = NCP302155A: Integrated Driver and MOSFET
U22 = ACS724LLCTR-xxxx: Automotive-Grade, Galvanically Isolated Current Sensor IC with Common-Mode Field Rejection
U23 U25 = 74LVC1G97: Logic gate configurabile
U24 = LMV358: as U19 on sheet Raspberry_Pwr; DatasheetDocument: Jan-1999; PackageDocument: Jul-1998; Publisher: Altium Limited; Code_JEDEC: MS-012-AA; Code_IPC: SO8; ComponentLink1Description: Manufacturer Link; ComponentLink1URL: http://www.st.com/; ComponentLink2Description: Datasheet; ComponentLink2URL: http://www.st.com/stonline/products/literature/ds/2300/tl082.pdf